# EAGLE design CFT-PB2-smd-revX (EAGLE 5.11)
DRAWN_BY: Alexios; PROJECT_NAME: CFT Mini-Computer; REVISION: Rev B; SHEET_DESCRIPTION: Address Register, Address Bus Drivers & Termination, Autoindex Logic, Device Decoder; SIMULATION_FILENAME: addressing.v; URL: http://www.bedroomlan.org/cft

## Sheet 1 of 6
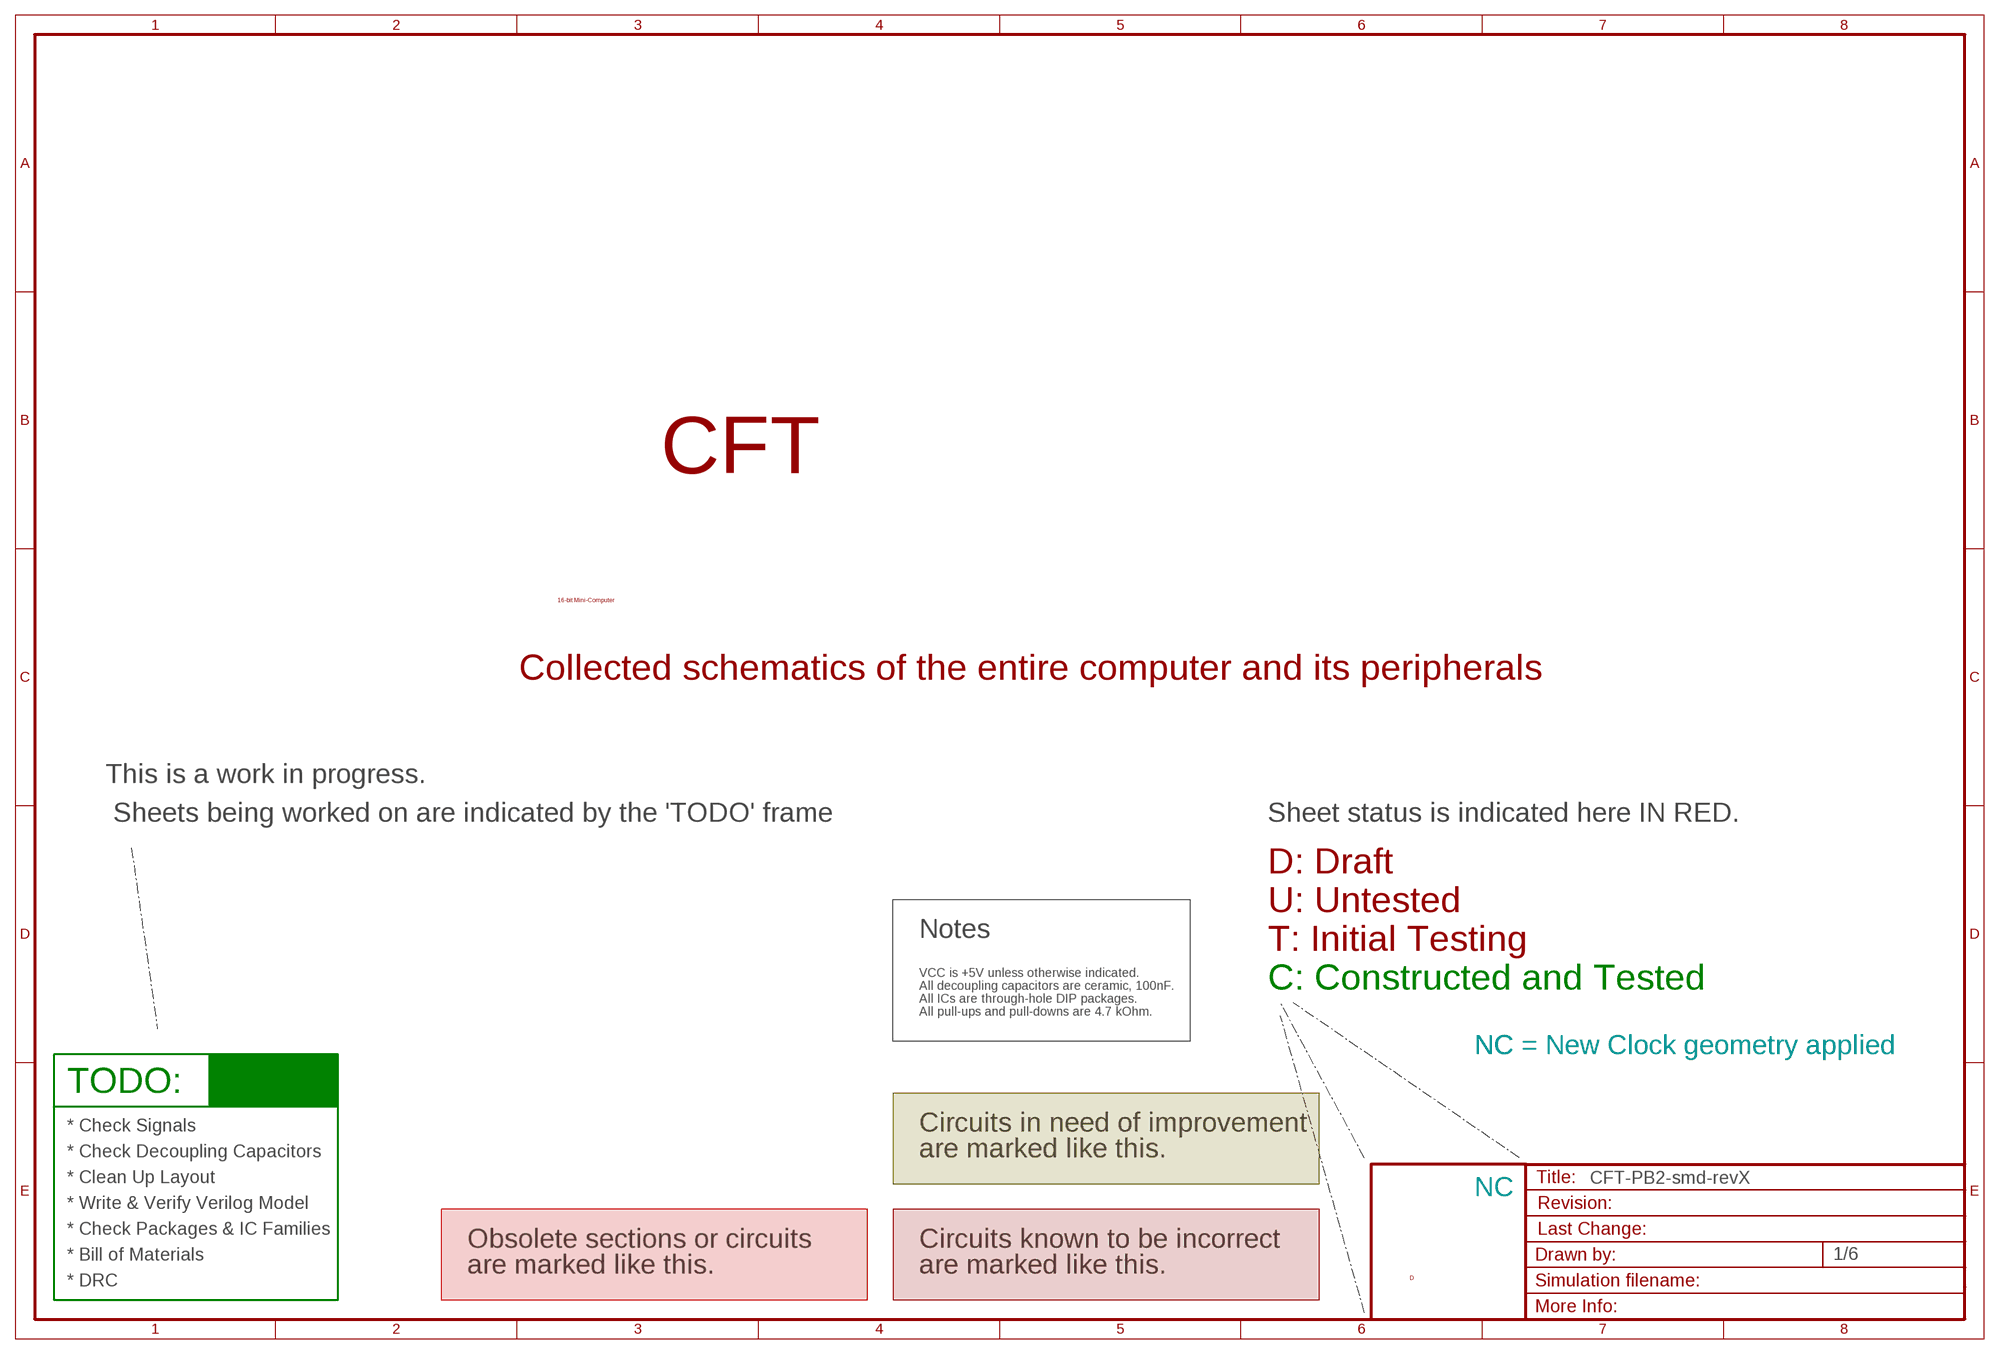
[diagram p0: schematic, sheet 1]

### Notes on the sheet
- CFT
- 16-bit Mini-Computer
- Collected schematics of the entire computer and its peripherals
- This is a work in progress.
- Sheets being worked on are indicated by the 'TODO' frame | Sheet status is indicated here IN RED.
- D: Draft
- U: Untested
- Notes
- T: Initial Testing
- VCC is +5V unless otherwise indicated.
- All decoupling capacitors are ceramic, 100nF. | C: Constructed and Tested
- All ICs are through-hole DIP packages.
- All pull-ups and pull-downs are 4.7 kOhm.
- NC | NC = New Clock geometry applied
- TODO:
- * Check Signals | Circuits in need of improvement
- * Check Decoupling Capacitors | are marked like this.
- * Clean Up Layout
- NC
- * Write & Verify Verilog Model
- * Check Packages & IC Families
- Obsolete sections or circuits | Circuits known to be incorrect
- * Bill of Materials
- are marked like this. | are marked like this.
- D
- * DRC

## Sheet 2 of 6
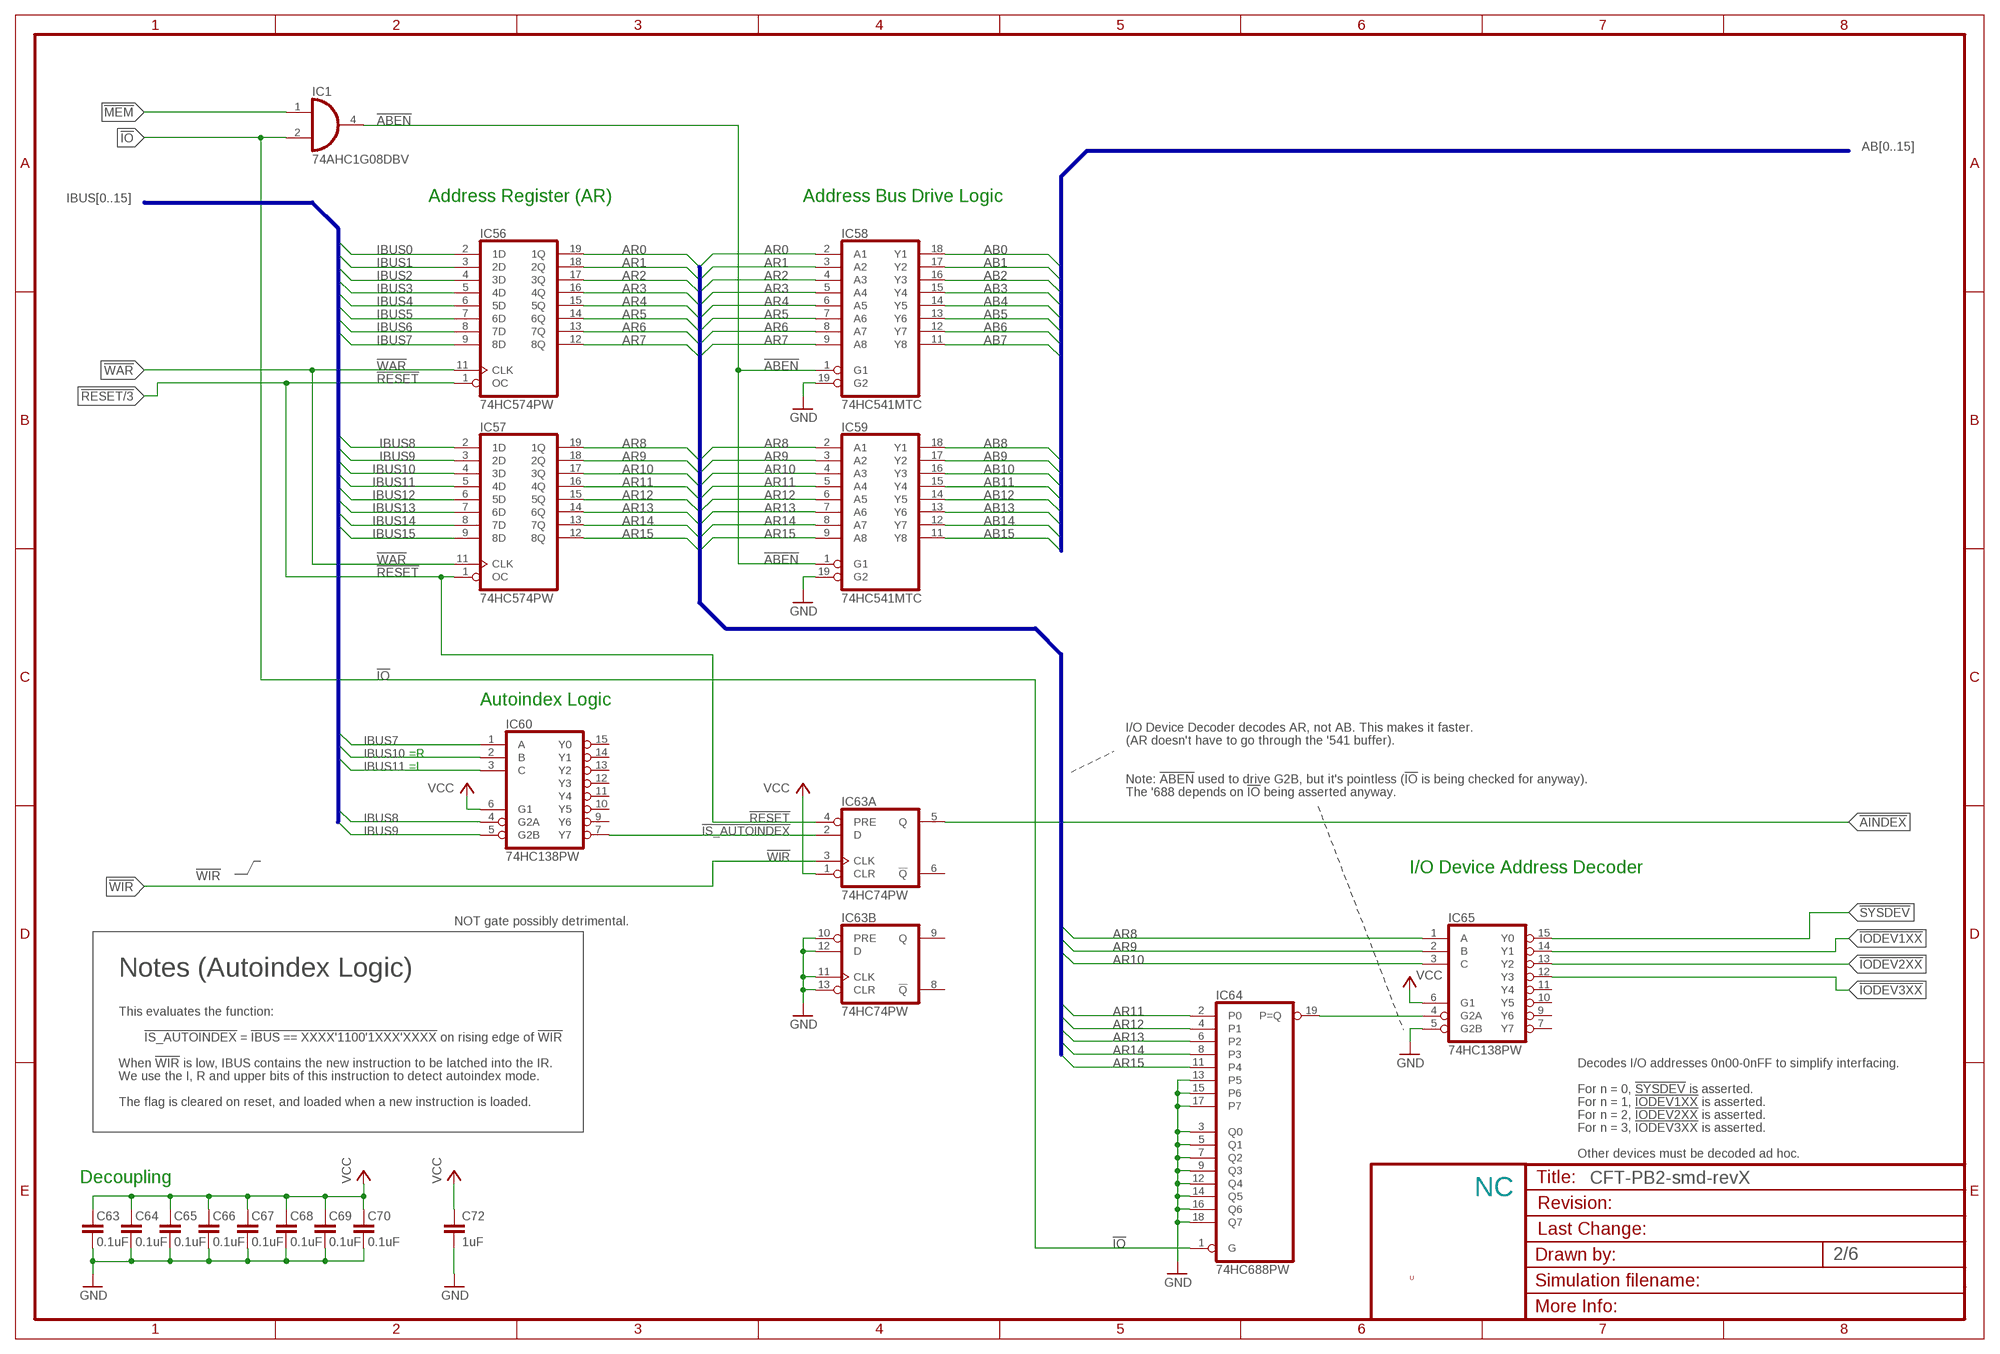
[diagram p1: schematic, sheet 2]

### Parts
C63  0.1uF  C-EUC0805K  [C0805K]
C64  0.1uF  C-EUC0805K  [C0805K]
C65  0.1uF  C-EUC0805K  [C0805K]
C66  0.1uF  C-EUC0805K  [C0805K]
C67  0.1uF  C-EUC0805K  [C0805K]
C68  0.1uF  C-EUC0805K  [C0805K]
C69  0.1uF  C-EUC0805K  [C0805K]
C70  0.1uF  C-EUC0805K  [C0805K]
C72  1uF  C-EUC0805K  [C0805K]
IC1  74AHC1G08DBV  [SOT23-5]
IC56  74HC574PW  [TSSOP20]
IC57  74HC574PW  [TSSOP20]
IC58  74HC541MTC  [TSSOP20]
IC59  74HC541MTC  [TSSOP20]
IC60  74HC138PW  [TSSOP16]
IC63  74HC74PW  [TSSOP16]
IC64  74HC688PW  [TSSOP20]
IC65  74HC138PW  [TSSOP16]

### Nets
!ABEN: IC1.4(O) IC58.1(G1) IC59.1(G1)
!AINDEX: IC63.5(A:Q) ; also sheet 6
!IO: IC1.2(I1) IC64.1(G) ; also sheet 6
!IODEV1XX: IC65.14(Y1) ; also sheet 6
!IODEV2XX: IC65.13(Y2) ; also sheet 6
!IODEV3XX: IC65.12(Y3) ; also sheet 6
!IS_AUTOINDEX: IC60.7(Y7) IC63.2(A:D)
!MEM: IC1.1(I0) ; also sheet 6
!RESET: IC56.1(OC) IC57.1(OC) IC63.4(A:PRE) ; also sheet 3,6
!SYSDEV: IC65.15(Y0) ; also sheet 6
!WAR: IC56.11(CLK) IC57.11(CLK) ; also sheet 6
!WIR: IC63.3(A:CLK) ; also sheet 6
AB0: IC58.18(Y1) ; also sheet 6
AB1: IC58.17(Y2) ; also sheet 6
AB2: IC58.16(Y3) ; also sheet 6
AB3: IC58.15(Y4) ; also sheet 6
AB4: IC58.14(Y5) ; also sheet 6
AB5: IC58.13(Y6) ; also sheet 6
AB6: IC58.12(Y7) ; also sheet 6
AB7: IC58.11(Y8) ; also sheet 6
AB8: IC59.18(Y1) ; also sheet 6
AB9: IC59.17(Y2) ; also sheet 6
AB10: IC59.16(Y3) ; also sheet 6
AB11: IC59.15(Y4) ; also sheet 6
AB12: IC59.14(Y5) ; also sheet 6
AB13: IC59.13(Y6) ; also sheet 6
AB14: IC59.12(Y7) ; also sheet 6
AB15: IC59.11(Y8) ; also sheet 6
AR0: IC56.19(1Q) IC58.2(A1)
AR1: IC56.18(2Q) IC58.3(A2)
AR2: IC56.17(3Q) IC58.4(A3)
AR3: IC56.16(4Q) IC58.5(A4)
AR4: IC56.15(5Q) IC58.6(A5)
AR5: IC56.14(6Q) IC58.7(A6)
AR6: IC56.13(7Q) IC58.8(A7)
AR7: IC56.12(8Q) IC58.9(A8)
AR8: IC57.19(1Q) IC59.2(A1) IC65.1(A)
AR9: IC57.18(2Q) IC59.3(A2) IC65.2(B)
AR10: IC57.17(3Q) IC59.4(A3) IC65.3(C)
AR11: IC57.16(4Q) IC59.5(A4) IC64.2(P0)
AR12: IC57.15(5Q) IC59.6(A5) IC64.4(P1)
AR13: IC57.14(6Q) IC59.7(A6) IC64.6(P2)
AR14: IC57.13(7Q) IC59.8(A7) IC64.8(P3)
AR15: IC57.12(8Q) IC59.9(A8) IC64.11(P4)
GND [low power]: C63.1 C64.1 C65.1 C66.1 C67.1 C68.1 C69.1 C70.1 C72.2 IC58.19(G2) IC59.19(G2) IC63.10(B:PRE) IC63.11(B:CLK) IC63.12(B:D) IC63.13(B:CLR) IC64.3(Q0) IC64.5(Q1) IC64.7(Q2) IC64.9(Q3) IC64.12(Q4) IC64.13(P5) IC64.14(Q5) IC64.15(P6) IC64.16(Q6) IC64.17(P7) IC64.18(Q7) IC65.5(G2B) ; also sheet 3,4,5,6
IBUS0: IC56.2(1D) ; also sheet 3,4,5,6
IBUS1: IC56.3(2D) ; also sheet 3,4,5,6
IBUS2: IC56.4(3D) ; also sheet 3,4,5,6
IBUS3: IC56.5(4D) ; also sheet 3,4,5,6
IBUS4: IC56.6(5D) ; also sheet 3,4,5,6
IBUS5: IC56.7(6D) ; also sheet 3,4,5,6
IBUS6: IC56.8(7D) ; also sheet 3,4,5,6
IBUS7: IC56.9(8D) IC60.1(A) ; also sheet 3,4,5,6
IBUS8: IC57.2(1D) IC60.4(G2A) ; also sheet 3,4,5,6
IBUS9: IC57.3(2D) IC60.5(G2B) ; also sheet 3,4,5,6
IBUS10: IC57.4(3D) IC60.2(B) ; also sheet 3,4,5,6
IBUS11: IC57.5(4D) IC60.3(C) ; also sheet 3,4,5,6
IBUS12: IC57.6(5D) ; also sheet 3,4,5,6
IBUS13: IC57.7(6D) ; also sheet 3,4,5,6
IBUS14: IC57.8(7D) ; also sheet 3,4,5,6
IBUS15: IC57.9(8D) ; also sheet 3,4,5,6
N$95: IC64.19(P=Q) IC65.4(G2A)
VCC [low power]: C63.2 C64.2 C65.2 C66.2 C67.2 C68.2 C69.2 C70.2 C72.1 IC60.6(G1) IC63.1(A:CLR) IC65.6(G1) ; also sheet 3,4,5,6
Unconnected: IC60.9(Y6) IC60.10(Y5) IC60.11(Y4) IC60.12(Y3) IC60.13(Y2) IC60.14(Y1) IC60.15(Y0) IC63.6(A:!Q) IC63.8(B:!Q) IC63.9(B:Q) IC65.7(Y7) IC65.9(Y6) IC65.10(Y5) IC65.11(Y4)

### Buses
AR[0..15]
IBUS[0..15]
AB[0..15]

### Notes on the sheet
- Address Register (AR) | Address Bus Drive Logic
- Autoindex Logic
- I/O Device Decoder decodes AR, not AB. This makes it faster.
- (AR doesn't have to go through the '541 buffer).
- =R
- =I
- Note: !ABEN! used to drive G2B, but it's pointless (!IO! is being checked for anyway).
- The '688 depends on !IO! being asserted anyway.
- I/O Device Address Decoder
- NOT gate possibly detrimental.
- Notes (Autoindex Logic)
- This evaluates the function:
- !IS_AUTOINDEX! = !IBUS == XXXX'1100'1XXX'XXXX! on rising edge of !WIR!
- When !WIR! is low, IBUS contains the new instruction to be latched into the IR. | Decodes I/O addresses 0n00-0nFF to simplify interfacing.
- We use the I, R and upper bits of this instruction to detect autoindex mode.
- For n = 0, !SYSDEV! is asserted.
- The flag is cleared on reset, and loaded when a new instruction is loaded. | For n = 1, !IODEV1XX! is asserted.
- For n = 2, !IODEV2XX! is asserted.
- For n = 3, !IODEV3XX! is asserted.
- Other devices must be decoded ad hoc.
- Decoupling
- NC
- U

## Sheet 3 of 6
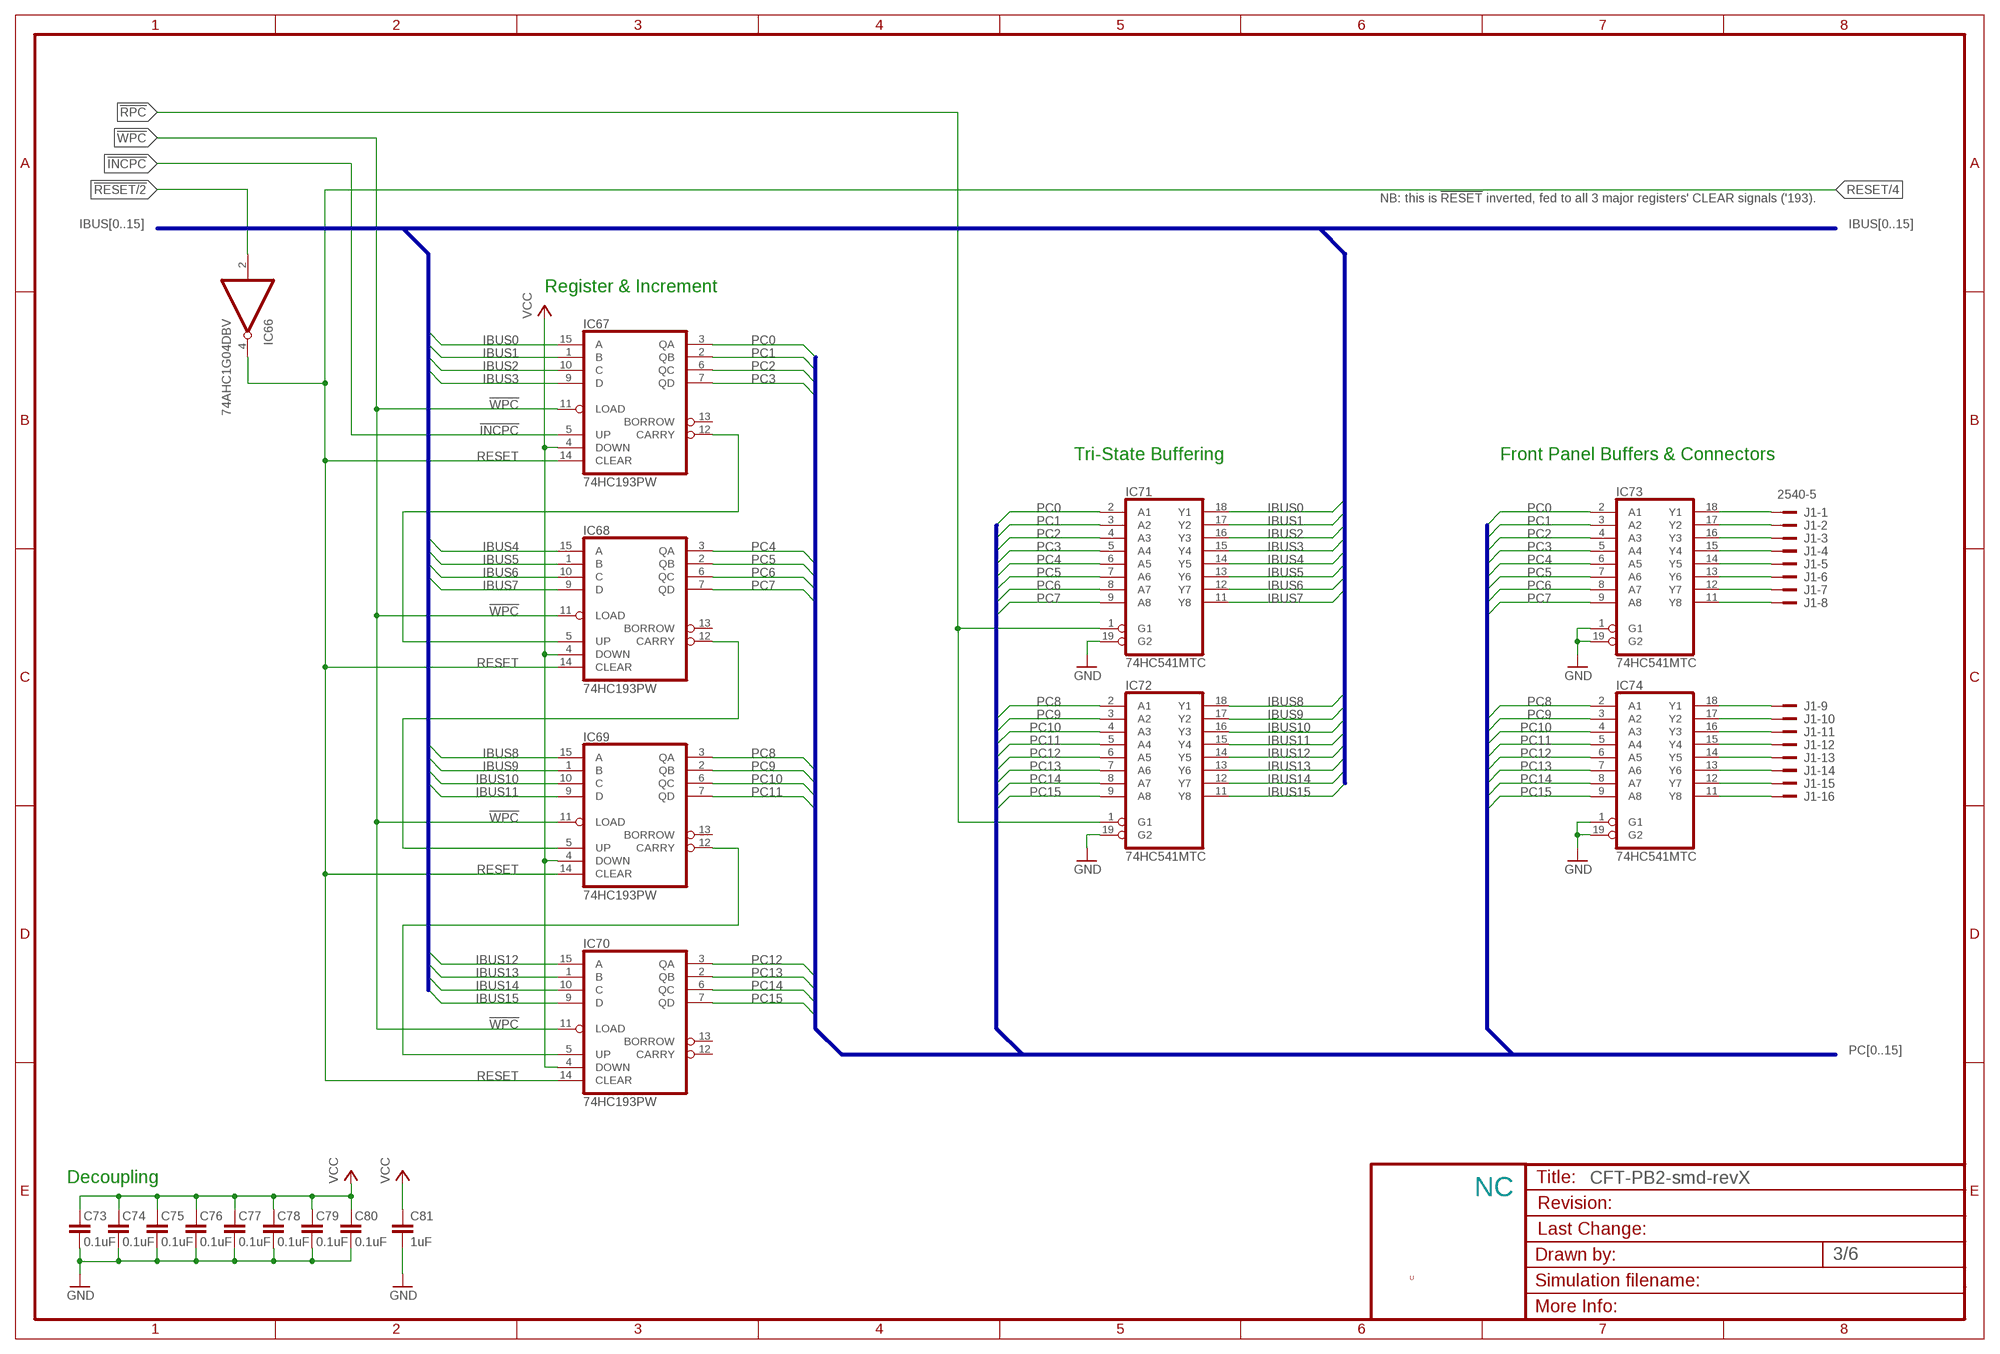
[diagram p2: schematic, sheet 3]

### Parts
C73  0.1uF  C-EUC0805K  [C0805K]
C74  0.1uF  C-EUC0805K  [C0805K]
C75  0.1uF  C-EUC0805K  [C0805K]
C76  0.1uF  C-EUC0805K  [C0805K]
C77  0.1uF  C-EUC0805K  [C0805K]
C78  0.1uF  C-EUC0805K  [C0805K]
C79  0.1uF  C-EUC0805K  [C0805K]
C80  0.1uF  C-EUC0805K  [C0805K]
C81  1uF  C-EUC0805K  [C0805K]
IC66  74AHC1G04DBV  [SOT23-5]
IC67  74HC193PW  [TSSOP16]
IC68  74HC193PW  [TSSOP16]
IC69  74HC193PW  [TSSOP16]
IC70  74HC193PW  [TSSOP16]
IC71  74HC541MTC  [TSSOP20]
IC72  74HC541MTC  [TSSOP20]
IC73  74HC541MTC  [TSSOP20]
IC74  74HC541MTC  [TSSOP20]
J1  2540-5  [PAK100/2500-5-40]

### Nets
!INCPC: IC67.5(UP) ; also sheet 6
!RESET: IC66.2(I) ; also sheet 2,6
!RPC: IC71.1(G1) IC72.1(G1) ; also sheet 6
!WPC: IC67.11(LOAD) IC68.11(LOAD) IC69.11(LOAD) IC70.11(LOAD) ; also sheet 6
GND [low power]: C73.1 C74.1 C75.1 C76.1 C77.1 C78.1 C79.1 C80.1 C81.2 IC71.19(G2) IC72.19(G2) IC73.1(G1) IC73.19(G2) IC74.1(G1) IC74.19(G2) ; also sheet 2,4,5,6
IBUS0: IC67.15(A) IC71.18(Y1) ; also sheet 2,4,5,6
IBUS1: IC67.1(B) IC71.17(Y2) ; also sheet 2,4,5,6
IBUS2: IC67.10(C) IC71.16(Y3) ; also sheet 2,4,5,6
IBUS3: IC67.9(D) IC71.15(Y4) ; also sheet 2,4,5,6
IBUS4: IC68.15(A) IC71.14(Y5) ; also sheet 2,4,5,6
IBUS5: IC68.1(B) IC71.13(Y6) ; also sheet 2,4,5,6
IBUS6: IC68.10(C) IC71.12(Y7) ; also sheet 2,4,5,6
IBUS7: IC68.9(D) IC71.11(Y8) ; also sheet 2,4,5,6
IBUS8: IC69.15(A) IC72.18(Y1) ; also sheet 2,4,5,6
IBUS9: IC69.1(B) IC72.17(Y2) ; also sheet 2,4,5,6
IBUS10: IC69.10(C) IC72.16(Y3) ; also sheet 2,4,5,6
IBUS11: IC69.9(D) IC72.15(Y4) ; also sheet 2,4,5,6
IBUS12: IC70.15(A) IC72.14(Y5) ; also sheet 2,4,5,6
IBUS13: IC70.1(B) IC72.13(Y6) ; also sheet 2,4,5,6
IBUS14: IC70.10(C) IC72.12(Y7) ; also sheet 2,4,5,6
IBUS15: IC70.9(D) IC72.11(Y8) ; also sheet 2,4,5,6
N$70: IC67.12(CARRY) IC68.5(UP)
N$71: IC68.12(CARRY) IC69.5(UP)
N$734: IC69.12(CARRY) IC70.5(UP)
N$736: IC73.18(Y1) J1.1
N$737: IC73.17(Y2) J1.2
N$738: IC73.16(Y3) J1.3
N$740: IC73.15(Y4) J1.4
N$741: IC73.14(Y5) J1.5
N$742: IC73.13(Y6) J1.6
N$743: IC73.12(Y7) J1.7
N$744: IC73.11(Y8) J1.8
N$745: IC74.18(Y1) J1.9
N$746: IC74.17(Y2) J1.10
N$747: IC74.16(Y3) J1.11
N$748: IC74.15(Y4) J1.12
N$749: IC74.14(Y5) J1.13
N$750: IC74.13(Y6) J1.14
N$751: IC74.12(Y7) J1.15
N$752: IC74.11(Y8) J1.16
PC0: IC67.3(QA) IC71.2(A1) IC73.2(A1)
PC1: IC67.2(QB) IC71.3(A2) IC73.3(A2)
PC2: IC67.6(QC) IC71.4(A3) IC73.4(A3)
PC3: IC67.7(QD) IC71.5(A4) IC73.5(A4)
PC4: IC68.3(QA) IC71.6(A5) IC73.6(A5)
PC5: IC68.2(QB) IC71.7(A6) IC73.7(A6)
PC6: IC68.6(QC) IC71.8(A7) IC73.8(A7)
PC7: IC68.7(QD) IC71.9(A8) IC73.9(A8)
PC8: IC69.3(QA) IC72.2(A1) IC74.2(A1)
PC9: IC69.2(QB) IC72.3(A2) IC74.3(A2)
PC10: IC69.6(QC) IC72.4(A3) IC74.4(A3) ; also sheet 6
PC11: IC69.7(QD) IC72.5(A4) IC74.5(A4) ; also sheet 6
PC12: IC70.3(QA) IC72.6(A5) IC74.6(A5) ; also sheet 6
PC13: IC70.2(QB) IC72.7(A6) IC74.7(A6) ; also sheet 6
PC14: IC70.6(QC) IC72.8(A7) IC74.8(A7) ; also sheet 6
PC15: IC70.7(QD) IC72.9(A8) IC74.9(A8) ; also sheet 6
RESET: IC66.4(O) IC67.14(CLEAR) IC68.14(CLEAR) IC69.14(CLEAR) IC70.14(CLEAR) ; also sheet 4,5
VCC [low power]: C73.2 C74.2 C75.2 C76.2 C77.2 C78.2 C79.2 C80.2 C81.1 IC67.4(DOWN) IC68.4(DOWN) IC69.4(DOWN) IC70.4(DOWN) ; also sheet 2,4,5,6
Unconnected: IC67.13(BORROW) IC68.13(BORROW) IC69.13(BORROW) IC70.12(CARRY) IC70.13(BORROW)

### Buses
IBUS[0..15]
PC[0..15]

### Notes on the sheet
- NB: this is !RESET! inverted, fed to all 3 major registers' CLEAR signals ('193).
- Register & Increment
- Tri-State Buffering | Front Panel Buffers & Connectors
- Decoupling
- NC
- U

## Sheet 4 of 6
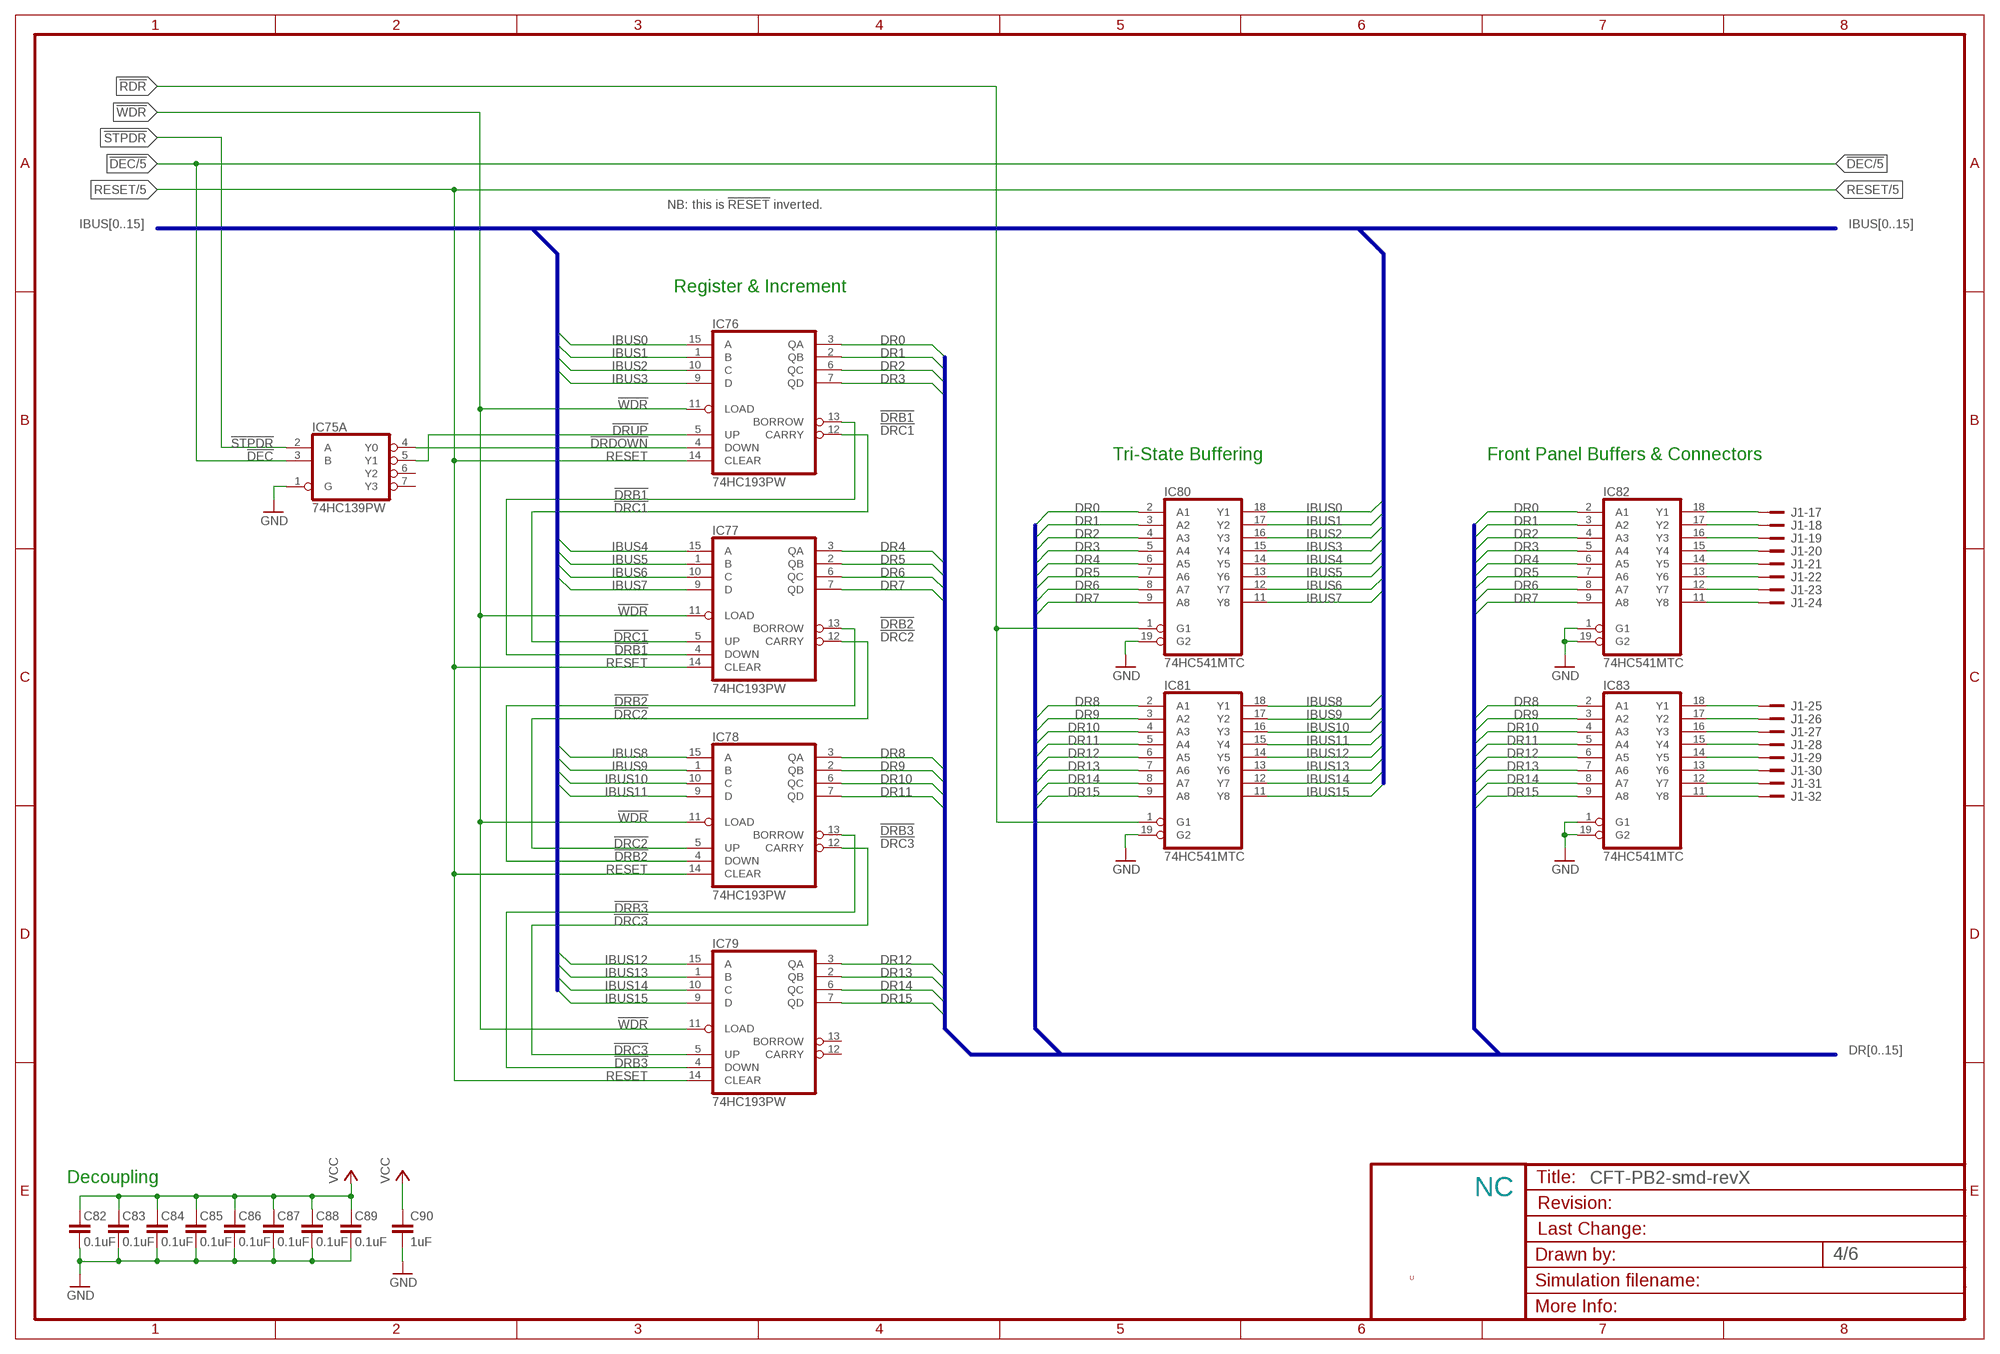
[diagram p3: schematic, sheet 4]

### Parts
C82  0.1uF  C-EUC0805K  [C0805K]
C83  0.1uF  C-EUC0805K  [C0805K]
C84  0.1uF  C-EUC0805K  [C0805K]
C85  0.1uF  C-EUC0805K  [C0805K]
C86  0.1uF  C-EUC0805K  [C0805K]
C87  0.1uF  C-EUC0805K  [C0805K]
C88  0.1uF  C-EUC0805K  [C0805K]
C89  0.1uF  C-EUC0805K  [C0805K]
C90  1uF  C-EUC0805K  [C0805K]
IC75  74HC139PW  [TSSOP16]
IC76  74HC193PW  [TSSOP16]
IC77  74HC193PW  [TSSOP16]
IC78  74HC193PW  [TSSOP16]
IC79  74HC193PW  [TSSOP16]
IC80  74HC541MTC  [TSSOP20]
IC81  74HC541MTC  [TSSOP20]
IC82  74HC541MTC  [TSSOP20]
IC83  74HC541MTC  [TSSOP20]

### Nets
!DEC: IC75.3(A:B) ; also sheet 5,6
!DRB1: IC76.13(BORROW) IC77.4(DOWN)
!DRB2: IC77.13(BORROW) IC78.4(DOWN)
!DRB3: IC78.13(BORROW) IC79.4(DOWN)
!DRC1: IC76.12(CARRY) IC77.5(UP)
!DRC2: IC77.12(CARRY) IC78.5(UP)
!DRC3: IC78.12(CARRY) IC79.5(UP)
!DRDOWN: IC75.4(A:Y0) IC76.4(DOWN)
!DRUP: IC75.5(A:Y1) IC76.5(UP)
!RDR: IC80.1(G1) IC81.1(G1) ; also sheet 6
!STPDR: IC75.2(A:A) ; also sheet 6
!WDR: IC76.11(LOAD) IC77.11(LOAD) IC78.11(LOAD) IC79.11(LOAD) ; also sheet 6
DR0: IC76.3(QA) IC80.2(A1) IC82.2(A1)
DR1: IC76.2(QB) IC80.3(A2) IC82.3(A2)
DR2: IC76.6(QC) IC80.4(A3) IC82.4(A3)
DR3: IC76.7(QD) IC80.5(A4) IC82.5(A4)
DR4: IC77.3(QA) IC80.6(A5) IC82.6(A5)
DR5: IC77.2(QB) IC80.7(A6) IC82.7(A6)
DR6: IC77.6(QC) IC80.8(A7) IC82.8(A7)
DR7: IC77.7(QD) IC80.9(A8) IC82.9(A8)
DR8: IC78.3(QA) IC81.2(A1) IC83.2(A1)
DR9: IC78.2(QB) IC81.3(A2) IC83.3(A2)
DR10: IC78.6(QC) IC81.4(A3) IC83.4(A3)
DR11: IC78.7(QD) IC81.5(A4) IC83.5(A4)
DR12: IC79.3(QA) IC81.6(A5) IC83.6(A5)
DR13: IC79.2(QB) IC81.7(A6) IC83.7(A6)
DR14: IC79.6(QC) IC81.8(A7) IC83.8(A7)
DR15: IC79.7(QD) IC81.9(A8) IC83.9(A8)
GND [low power]: C82.1 C83.1 C84.1 C85.1 C86.1 C87.1 C88.1 C89.1 C90.2 IC75.1(A:G) IC80.19(G2) IC81.19(G2) IC82.1(G1) IC82.19(G2) IC83.1(G1) IC83.19(G2) ; also sheet 2,3,5,6
IBUS0: IC76.15(A) IC80.18(Y1) ; also sheet 2,3,5,6
IBUS1: IC76.1(B) IC80.17(Y2) ; also sheet 2,3,5,6
IBUS2: IC76.10(C) IC80.16(Y3) ; also sheet 2,3,5,6
IBUS3: IC76.9(D) IC80.15(Y4) ; also sheet 2,3,5,6
IBUS4: IC77.15(A) IC80.14(Y5) ; also sheet 2,3,5,6
IBUS5: IC77.1(B) IC80.13(Y6) ; also sheet 2,3,5,6
IBUS6: IC77.10(C) IC80.12(Y7) ; also sheet 2,3,5,6
IBUS7: IC77.9(D) IC80.11(Y8) ; also sheet 2,3,5,6
IBUS8: IC78.15(A) IC81.18(Y1) ; also sheet 2,3,5,6
IBUS9: IC78.1(B) IC81.17(Y2) ; also sheet 2,3,5,6
IBUS10: IC78.10(C) IC81.16(Y3) ; also sheet 2,3,5,6
IBUS11: IC78.9(D) IC81.15(Y4) ; also sheet 2,3,5,6
IBUS12: IC79.15(A) IC81.14(Y5) ; also sheet 2,3,5,6
IBUS13: IC79.1(B) IC81.13(Y6) ; also sheet 2,3,5,6
IBUS14: IC79.10(C) IC81.12(Y7) ; also sheet 2,3,5,6
IBUS15: IC79.9(D) IC81.11(Y8) ; also sheet 2,3,5,6
N$753: IC82.18(Y1) J1.17
N$754: IC82.17(Y2) J1.18
N$755: IC82.16(Y3) J1.19
N$756: IC82.15(Y4) J1.20
N$757: IC82.14(Y5) J1.21
N$758: IC82.13(Y6) J1.22
N$759: IC82.12(Y7) J1.23
N$760: IC82.11(Y8) J1.24
N$761: IC83.18(Y1) J1.25
N$762: IC83.17(Y2) J1.26
N$763: IC83.16(Y3) J1.27
N$764: IC83.15(Y4) J1.28
N$765: IC83.14(Y5) J1.29
N$766: IC83.13(Y6) J1.30
N$767: IC83.12(Y7) J1.31
N$768: IC83.11(Y8) J1.32
RESET: IC76.14(CLEAR) IC77.14(CLEAR) IC78.14(CLEAR) IC79.14(CLEAR) ; also sheet 3,5
VCC [low power]: C82.2 C83.2 C84.2 C85.2 C86.2 C87.2 C88.2 C89.2 C90.1 ; also sheet 2,3,5,6
Unconnected: IC75.6(A:Y2) IC75.7(A:Y3) IC79.12(CARRY) IC79.13(BORROW)

### Buses
IBUS[0..15]
DR[0..15]

### Notes on the sheet
- NB: this is !RESET! inverted.
- Register & Increment
- Tri-State Buffering | Front Panel Buffers & Connectors
- Decoupling
- NC
- U

## Sheet 5 of 6
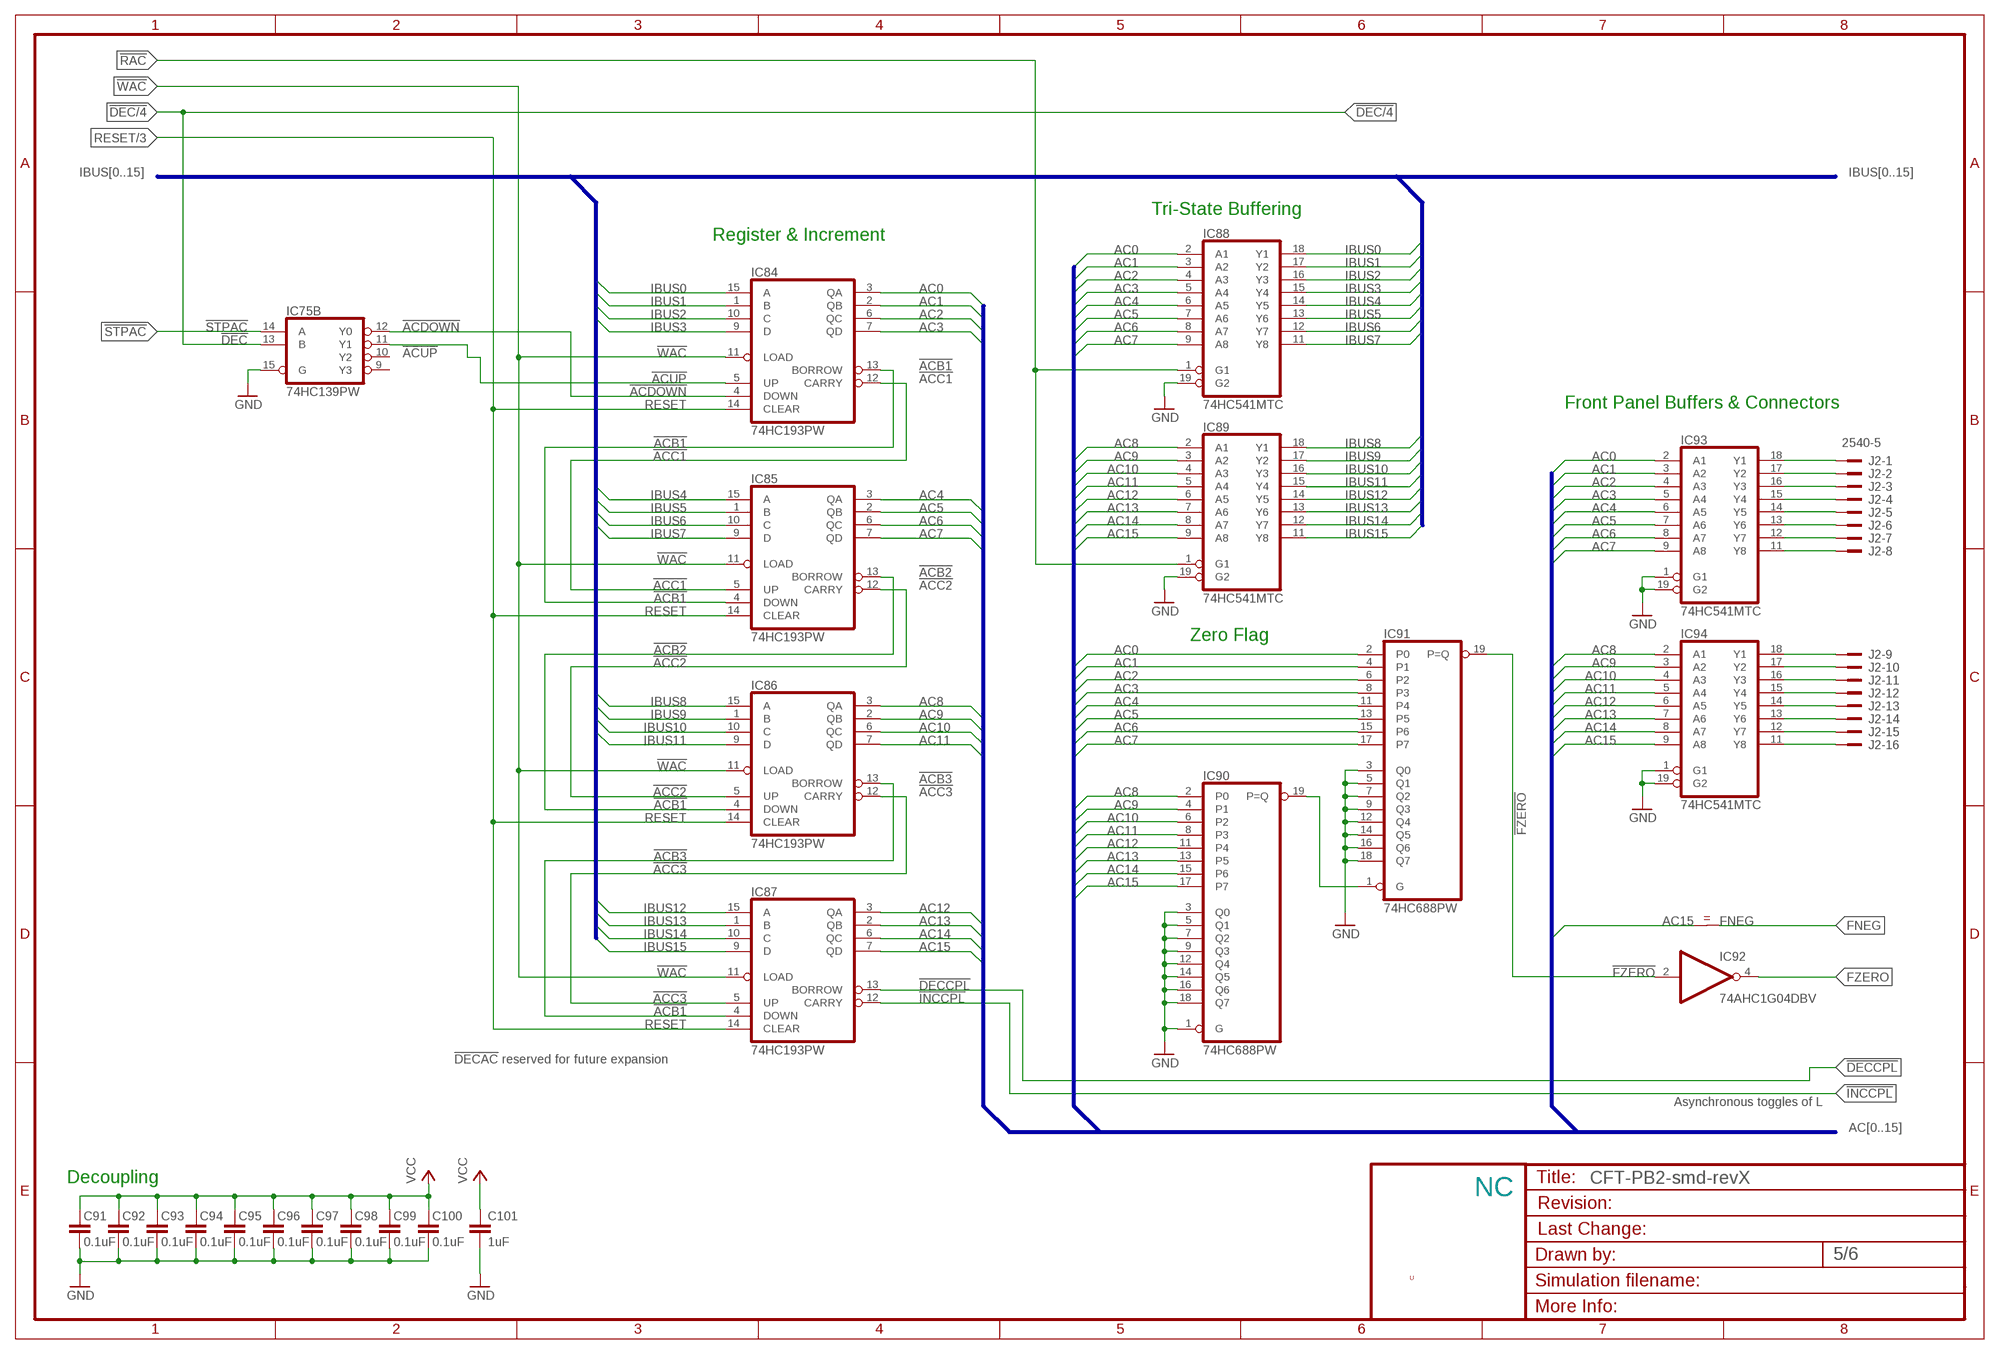
[diagram p4: schematic, sheet 5]

### Parts
C91  0.1uF  C-EUC0805K  [C0805K]
C92  0.1uF  C-EUC0805K  [C0805K]
C93  0.1uF  C-EUC0805K  [C0805K]
C94  0.1uF  C-EUC0805K  [C0805K]
C95  0.1uF  C-EUC0805K  [C0805K]
C96  0.1uF  C-EUC0805K  [C0805K]
C97  0.1uF  C-EUC0805K  [C0805K]
C98  0.1uF  C-EUC0805K  [C0805K]
C99  0.1uF  C-EUC0805K  [C0805K]
C100  0.1uF  C-EUC0805K  [C0805K]
C101  1uF  C-EUC0805K  [C0805K]
IC84  74HC193PW  [TSSOP16]
IC85  74HC193PW  [TSSOP16]
IC86  74HC193PW  [TSSOP16]
IC87  74HC193PW  [TSSOP16]
IC88  74HC541MTC  [TSSOP20]
IC89  74HC541MTC  [TSSOP20]
IC90  74HC688PW  [TSSOP20]
IC91  74HC688PW  [TSSOP20]
IC92  74AHC1G04DBV  [SOT23-5]
IC93  74HC541MTC  [TSSOP20]
IC94  74HC541MTC  [TSSOP20]
J2  2540-5  [PAK100/2500-5-40]
X1  SIGNAL-RENAME  [SIGNAL-RENAME]

### Nets
!ACB1: IC84.13(BORROW) IC85.4(DOWN)
!ACB2: IC85.13(BORROW) IC86.4(DOWN)
!ACB3: IC86.13(BORROW) IC87.4(DOWN)
!ACC1: IC84.12(CARRY) IC85.5(UP)
!ACC2: IC85.12(CARRY) IC86.5(UP)
!ACC3: IC86.12(CARRY) IC87.5(UP)
!ACDOWN: IC75.12(B:Y0) IC84.4(DOWN)
!ACUP: IC75.11(B:Y1) IC84.5(UP)
!DEC: IC75.13(B:B) ; also sheet 4,6
!DECCPL: IC87.13(BORROW) ; also sheet 6
!FZERO: IC91.19(P=Q) IC92.2(I)
!INCCPL: IC87.12(CARRY) ; also sheet 6
!RAC: IC88.1(G1) IC89.1(G1) ; also sheet 6
!STPAC: IC75.14(B:A) ; also sheet 6
!WAC: IC84.11(LOAD) IC85.11(LOAD) IC86.11(LOAD) IC87.11(LOAD) ; also sheet 6
AC0: IC84.3(QA) IC88.2(A1) IC91.2(P0) IC93.2(A1) ; also sheet 6
AC1: IC84.2(QB) IC88.3(A2) IC91.4(P1) IC93.3(A2) ; also sheet 6
AC2: IC84.6(QC) IC88.4(A3) IC91.6(P2) IC93.4(A3) ; also sheet 6
AC3: IC84.7(QD) IC88.5(A4) IC91.8(P3) IC93.5(A4) ; also sheet 6
AC4: IC85.3(QA) IC88.6(A5) IC91.11(P4) IC93.6(A5) ; also sheet 6
AC5: IC85.2(QB) IC88.7(A6) IC91.13(P5) IC93.7(A6) ; also sheet 6
AC6: IC85.6(QC) IC88.8(A7) IC91.15(P6) IC93.8(A7) ; also sheet 6
AC7: IC85.7(QD) IC88.9(A8) IC91.17(P7) IC93.9(A8) ; also sheet 6
AC8: IC86.3(QA) IC89.2(A1) IC90.2(P0) IC94.2(A1) ; also sheet 6
AC9: IC86.2(QB) IC89.3(A2) IC90.4(P1) IC94.3(A2) ; also sheet 6
AC10: IC86.6(QC) IC89.4(A3) IC90.6(P2) IC94.4(A3) ; also sheet 6
AC11: IC86.7(QD) IC89.5(A4) IC90.8(P3) IC94.5(A4) ; also sheet 6
AC12: IC87.3(QA) IC89.6(A5) IC90.11(P4) IC94.6(A5) ; also sheet 6
AC13: IC87.2(QB) IC89.7(A6) IC90.13(P5) IC94.7(A6) ; also sheet 6
AC14: IC87.6(QC) IC89.8(A7) IC90.15(P6) IC94.8(A7) ; also sheet 6
AC15: IC87.7(QD) IC89.9(A8) IC90.17(P7) IC94.9(A8) X1.P$1 ; also sheet 6
FNEG: X1.P$2 ; also sheet 6
FZERO: IC92.4(O) ; also sheet 6
GND [low power]: C91.1 C92.1 C93.1 C94.1 C95.1 C96.1 C97.1 C98.1 C99.1 C100.1 C101.2 IC75.15(B:G) IC88.19(G2) IC89.19(G2) IC90.1(G) IC90.3(Q0) IC90.5(Q1) IC90.7(Q2) IC90.9(Q3) IC90.12(Q4) IC90.14(Q5) IC90.16(Q6) IC90.18(Q7) IC91.3(Q0) IC91.5(Q1) IC91.7(Q2) IC91.9(Q3) IC91.12(Q4) IC91.14(Q5) IC91.16(Q6) IC91.18(Q7) IC93.1(G1) IC93.19(G2) IC94.1(G1) IC94.19(G2) ; also sheet 2,3,4,6
IBUS0: IC84.15(A) IC88.18(Y1) ; also sheet 2,3,4,6
IBUS1: IC84.1(B) IC88.17(Y2) ; also sheet 2,3,4,6
IBUS2: IC84.10(C) IC88.16(Y3) ; also sheet 2,3,4,6
IBUS3: IC84.9(D) IC88.15(Y4) ; also sheet 2,3,4,6
IBUS4: IC85.15(A) IC88.14(Y5) ; also sheet 2,3,4,6
IBUS5: IC85.1(B) IC88.13(Y6) ; also sheet 2,3,4,6
IBUS6: IC85.10(C) IC88.12(Y7) ; also sheet 2,3,4,6
IBUS7: IC85.9(D) IC88.11(Y8) ; also sheet 2,3,4,6
IBUS8: IC86.15(A) IC89.18(Y1) ; also sheet 2,3,4,6
IBUS9: IC86.1(B) IC89.17(Y2) ; also sheet 2,3,4,6
IBUS10: IC86.10(C) IC89.16(Y3) ; also sheet 2,3,4,6
IBUS11: IC86.9(D) IC89.15(Y4) ; also sheet 2,3,4,6
IBUS12: IC87.15(A) IC89.14(Y5) ; also sheet 2,3,4,6
IBUS13: IC87.1(B) IC89.13(Y6) ; also sheet 2,3,4,6
IBUS14: IC87.10(C) IC89.12(Y7) ; also sheet 2,3,4,6
IBUS15: IC87.9(D) IC89.11(Y8) ; also sheet 2,3,4,6
N$773: IC93.18(Y1) J2.1
N$775: IC93.17(Y2) J2.2
N$776: IC93.16(Y3) J2.3
N$777: IC93.15(Y4) J2.4
N$778: IC93.14(Y5) J2.5
N$779: IC93.13(Y6) J2.6
N$780: IC93.12(Y7) J2.7
N$781: IC93.11(Y8) J2.8
N$782: IC94.18(Y1) J2.9
N$783: IC94.17(Y2) J2.10
N$784: IC94.16(Y3) J2.11
N$785: IC94.15(Y4) J2.12
N$786: IC94.14(Y5) J2.13
N$787: IC94.13(Y6) J2.14
N$788: IC94.12(Y7) J2.15
N$789: IC94.11(Y8) J2.16
N$793: IC90.19(P=Q) IC91.1(G)
RESET: IC84.14(CLEAR) IC85.14(CLEAR) IC86.14(CLEAR) IC87.14(CLEAR) ; also sheet 3,4
VCC [low power]: C91.2 C92.2 C93.2 C94.2 C95.2 C96.2 C97.2 C98.2 C99.2 C100.2 C101.1 ; also sheet 2,3,4,6
Unconnected: IC75.9(B:Y3) IC75.10(B:Y2)

### Buses
IBUS[0..15]
AC[0..15]

### Notes on the sheet
- Tri-State Buffering
- Register & Increment
- Front Panel Buffers & Connectors
- Zero Flag
- !DECAC! reserved for future expansion
- Asynchronous toggles of L
- Decoupling
- NC
- U

## Sheet 6 of 6
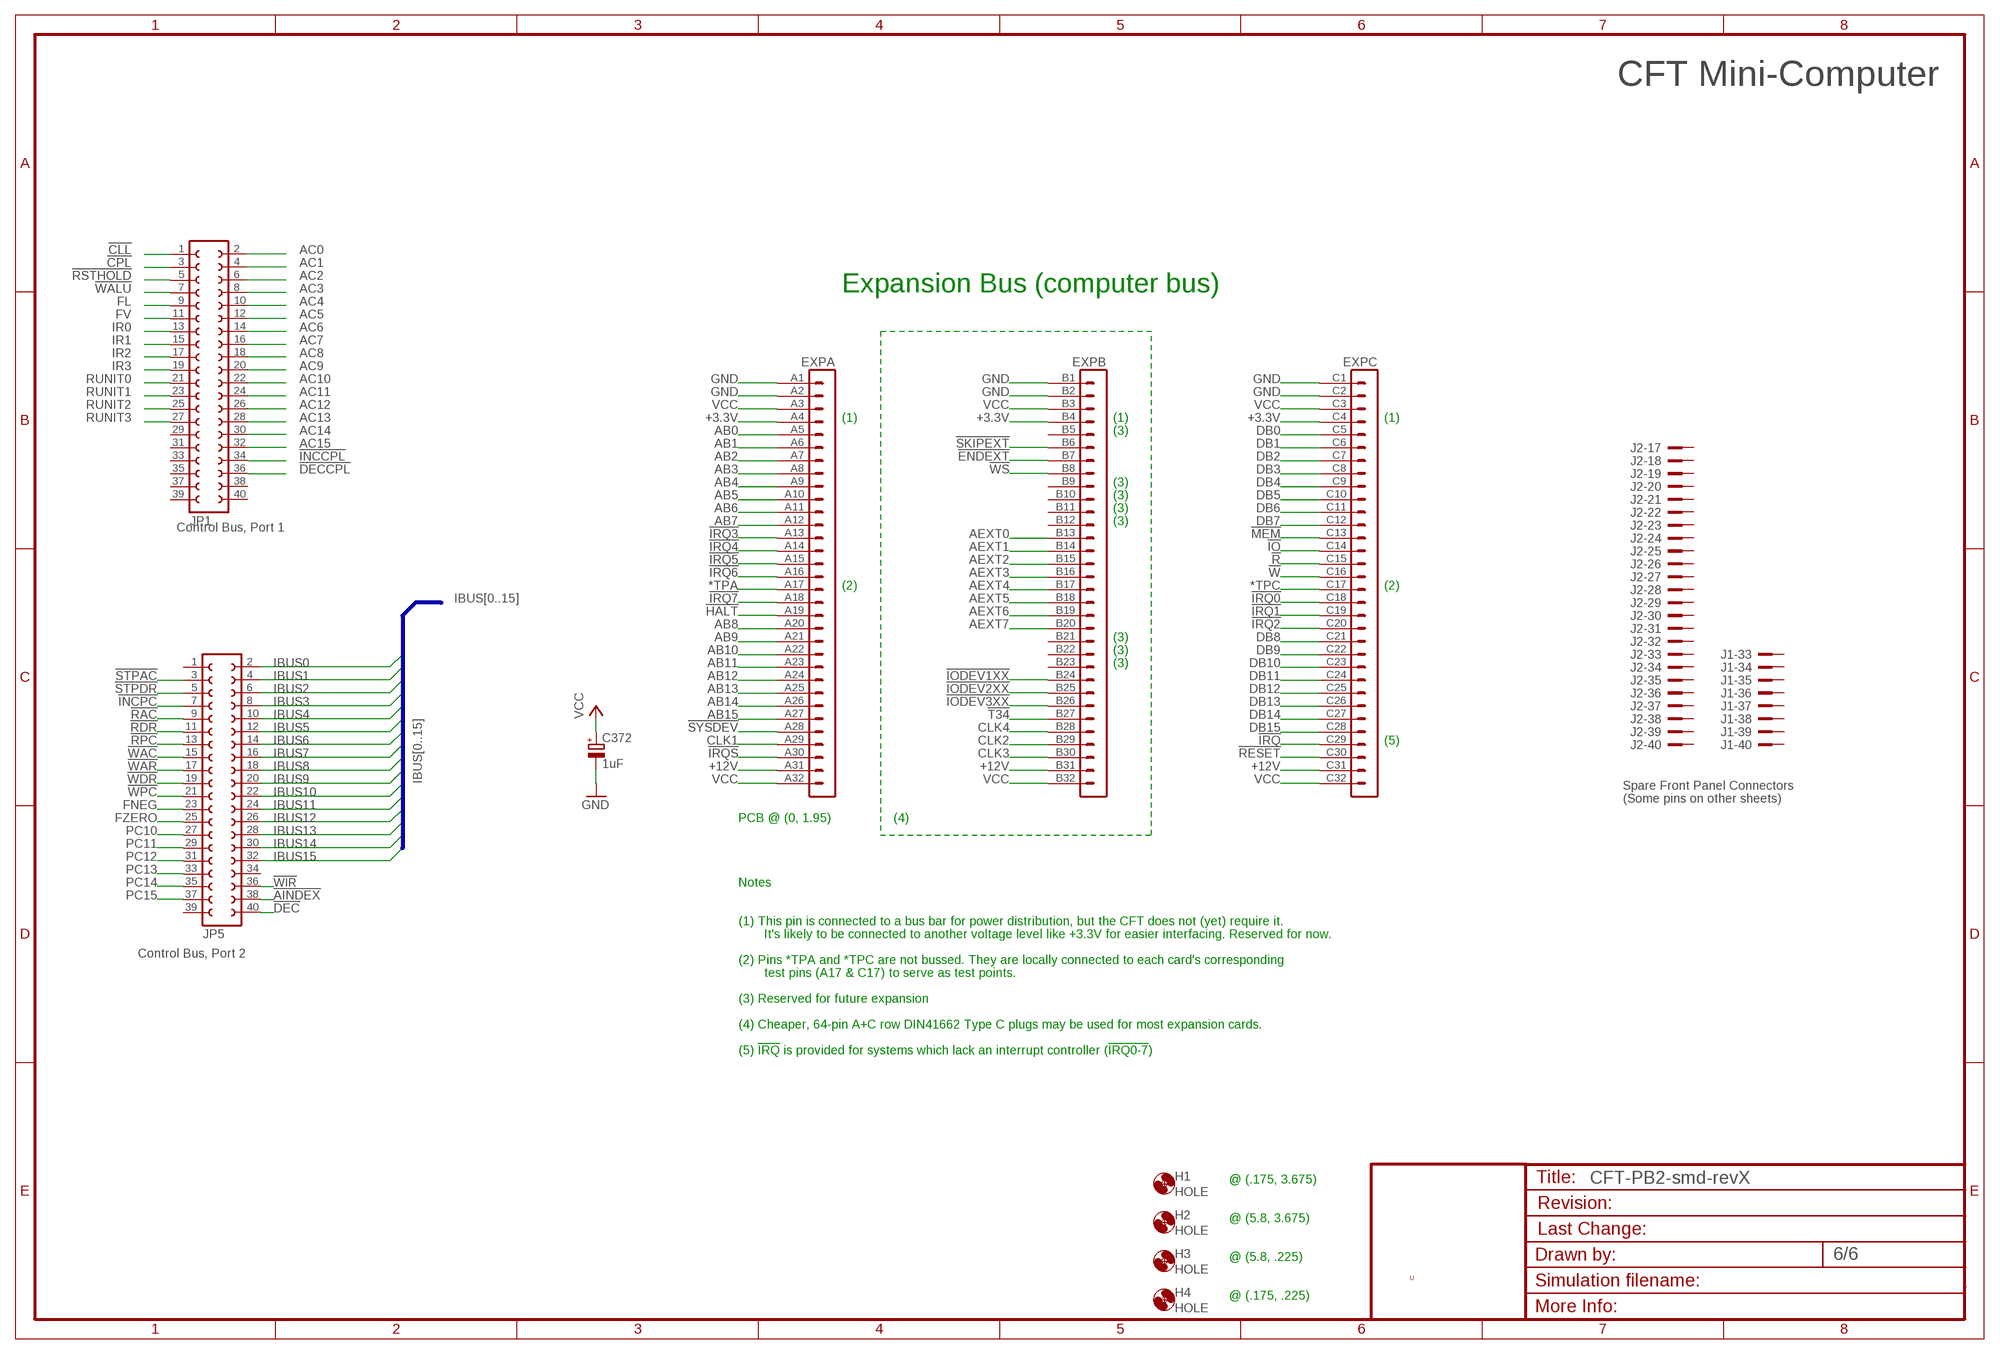
[diagram p5: schematic, sheet 6]

### Parts
C372  1uF  CPOL-EUE2.5-5  [E2,5-5]
EXP  VG96-3K  [VG96K]
H1  HOLE  [STANDOFF_28_60]
H2  HOLE  [STANDOFF_28_60]
H3  HOLE  [STANDOFF_28_60]
H4  HOLE  [STANDOFF_28_60]
JP1  FE20-2  [FE20-2]
JP5  FE20-2  [FE20-2]

### Nets
!AINDEX: JP5.38 ; also sheet 2
!CLL: JP1.1
!CPL: JP1.3
!DEC: JP5.40 ; also sheet 4,5
!DECCPL: JP1.36 ; also sheet 5
!ENDEXT: EXP.B7
!HALT: EXP.A19
!INCCPL: JP1.34 ; also sheet 5
!INCPC: JP5.7 ; also sheet 3
!IO: EXP.C14 ; also sheet 2
!IODEV1XX: EXP.B24 ; also sheet 2
!IODEV2XX: EXP.B25 ; also sheet 2
!IODEV3XX: EXP.B26 ; also sheet 2
!IRQ: EXP.C29
!IRQ0: EXP.C18
!IRQ1: EXP.C19
!IRQ2: EXP.C20
!IRQ3: EXP.A13
!IRQ4: EXP.A14
!IRQ5: EXP.A15
!IRQ6: EXP.A16
!IRQ7: EXP.A18
!IRQS: EXP.A30
!MEM: EXP.C13 ; also sheet 2
!R: EXP.C15
!RAC: JP5.9 ; also sheet 5
!RDR: JP5.11 ; also sheet 4
!RESET: EXP.C30 ; also sheet 2,3
!RPC: JP5.13 ; also sheet 3
!RSTHOLD: JP1.5
!SKIPEXT: EXP.B6
!STPAC: JP5.3 ; also sheet 5
!STPDR: JP5.5 ; also sheet 4
!SYSDEV: EXP.A28 ; also sheet 2
!T34: EXP.B27
!W: EXP.C16
!WAC: JP5.15 ; also sheet 5
!WALU: JP1.7
!WAR: JP5.17 ; also sheet 2
!WDR: JP5.19 ; also sheet 4
!WIR: JP5.36 ; also sheet 2
!WPC: JP5.21 ; also sheet 3
!WS: EXP.B8
*TPA: EXP.A17
*TPC: EXP.C17
+3.3V: EXP.A4 EXP.B4 EXP.C4
+12V [LED power]: EXP.A31 EXP.B31 EXP.C31
AB0: EXP.A5 ; also sheet 2
AB1: EXP.A6 ; also sheet 2
AB2: EXP.A7 ; also sheet 2
AB3: EXP.A8 ; also sheet 2
AB4: EXP.A9 ; also sheet 2
AB5: EXP.A10 ; also sheet 2
AB6: EXP.A11 ; also sheet 2
AB7: EXP.A12 ; also sheet 2
AB8: EXP.A20 ; also sheet 2
AB9: EXP.A21 ; also sheet 2
AB10: EXP.A22 ; also sheet 2
AB11: EXP.A23 ; also sheet 2
AB12: EXP.A24 ; also sheet 2
AB13: EXP.A25 ; also sheet 2
AB14: EXP.A26 ; also sheet 2
AB15: EXP.A27 ; also sheet 2
AC0: JP1.2 ; also sheet 5
AC1: JP1.4 ; also sheet 5
AC2: JP1.6 ; also sheet 5
AC3: JP1.8 ; also sheet 5
AC4: JP1.10 ; also sheet 5
AC5: JP1.12 ; also sheet 5
AC6: JP1.14 ; also sheet 5
AC7: JP1.16 ; also sheet 5
AC8: JP1.18 ; also sheet 5
AC9: JP1.20 ; also sheet 5
AC10: JP1.22 ; also sheet 5
AC11: JP1.24 ; also sheet 5
AC12: JP1.26 ; also sheet 5
AC13: JP1.28 ; also sheet 5
AC14: JP1.30 ; also sheet 5
AC15: JP1.32 ; also sheet 5
AEXT0: EXP.B13
AEXT1: EXP.B14
AEXT2: EXP.B15
AEXT3: EXP.B16
AEXT4: EXP.B17
AEXT5: EXP.B18
AEXT6: EXP.B19
AEXT7: EXP.B20
CLK1: EXP.A29
CLK2: EXP.B29
CLK3: EXP.B30
CLK4: EXP.B28
DB0: EXP.C5
DB1: EXP.C6
DB2: EXP.C7
DB3: EXP.C8
DB4: EXP.C9
DB5: EXP.C10
DB6: EXP.C11
DB7: EXP.C12
DB8: EXP.C21
DB9: EXP.C22
DB10: EXP.C23
DB11: EXP.C24
DB12: EXP.C25
DB13: EXP.C26
DB14: EXP.C27
DB15: EXP.C28
FL: JP1.9
FNEG: JP5.23 ; also sheet 5
FV: JP1.11
FZERO: JP5.25 ; also sheet 5
GND [low power]: C372.- EXP.A1 EXP.A2 EXP.B1 EXP.B2 EXP.C1 EXP.C2 ; also sheet 2,3,4,5
IBUS0: JP5.2 ; also sheet 2,3,4,5
IBUS1: JP5.4 ; also sheet 2,3,4,5
IBUS2: JP5.6 ; also sheet 2,3,4,5
IBUS3: JP5.8 ; also sheet 2,3,4,5
IBUS4: JP5.10 ; also sheet 2,3,4,5
IBUS5: JP5.12 ; also sheet 2,3,4,5
IBUS6: JP5.14 ; also sheet 2,3,4,5
IBUS7: JP5.16 ; also sheet 2,3,4,5
IBUS8: JP5.18 ; also sheet 2,3,4,5
IBUS9: JP5.20 ; also sheet 2,3,4,5
IBUS10: JP5.22 ; also sheet 2,3,4,5
IBUS11: JP5.24 ; also sheet 2,3,4,5
IBUS12: JP5.26 ; also sheet 2,3,4,5
IBUS13: JP5.28 ; also sheet 2,3,4,5
IBUS14: JP5.30 ; also sheet 2,3,4,5
IBUS15: JP5.32 ; also sheet 2,3,4,5
IR0: JP1.13
IR1: JP1.15
IR2: JP1.17
IR3: JP1.19
PC10: JP5.27 ; also sheet 3
PC11: JP5.29 ; also sheet 3
PC12: JP5.31 ; also sheet 3
PC13: JP5.33 ; also sheet 3
PC14: JP5.35 ; also sheet 3
PC15: JP5.37 ; also sheet 3
RUNIT0: JP1.21
RUNIT1: JP1.23
RUNIT2: JP1.25
RUNIT3: JP1.27
VCC [low power]: C372.+ EXP.A3 EXP.A32 EXP.B3 EXP.B32 EXP.C3 EXP.C32 ; also sheet 2,3,4,5
Unconnected: EXP.B5 EXP.B9 EXP.B10 EXP.B11 EXP.B12 EXP.B21 EXP.B22 EXP.B23 J1.33 J1.34 J1.35 J1.36 J1.37 J1.38 J1.39 J1.40 J2.17 J2.18 J2.19 J2.20 J2.21 J2.22 J2.23 J2.24 J2.25 J2.26 J2.27 J2.28 J2.29 J2.30 J2.31 J2.32 J2.33 J2.34 J2.35 J2.36 J2.37 J2.38 J2.39 J2.40 JP1.29 JP1.31 JP1.33 JP1.35 JP1.37 JP1.38 JP1.39 JP1.40 JP5.1 JP5.34 JP5.39

### Buses
IBUS[0..15]

### Notes on the sheet
- CFT Mini-Computer
- Expansion Bus (computer bus)
- (1) | (1) | (1)
- (3)
- (3)
- (3)
- (3)
- (3)
- Control Bus, Port 1
- (2) | (2)
- (3)
- (3)
- (3)
- (5)
- Spare Front Panel Connectors
- (Some pins on other sheets)
- PCB @ (0, 1.95) | (4)
- Notes
- (1) This pin is connected to a bus bar for power distribution, but the CFT does not (yet) require it.
- It's likely to be connected to another voltage level like +3.3V for easier interfacing. Reserved for now.
- Control Bus, Port 2
- (2) Pins *TPA and *TPC are not bussed. They are locally connected to each card's corresponding
- test pins (A17 & C17) to serve as test points.
- (3) Reserved for future expansion
- (4) Cheaper, 64-pin A+C row DIN41662 Type C plugs may be used for most expansion cards.
- (5) !IRQ! is provided for systems which lack an interrupt controller (!IRQ0-7!)
- @ (.175, 3.675)
- @ (5.8, 3.675)
- @ (5.8, .225)
- U
- @ (.175, .225)

## Power pins joined to a net without a drawn wire
GND: IC1.3(GND) IC56.10(GND) IC57.10(GND) IC58.10(GND) IC59.10(GND) IC60.8(GND) IC63.7(P:GND) IC64.10(GND) IC65.8(GND) IC66.3(GND) IC67.8(GND) IC68.8(GND) IC69.8(GND) IC70.8(GND) IC71.10(GND) IC72.10(GND) IC73.10(GND) IC74.10(GND) IC75.8(P:GND) IC76.8(GND) IC77.8(GND) IC78.8(GND) IC79.8(GND) IC80.10(GND) IC81.10(GND) IC82.10(GND) IC83.10(GND) IC84.8(GND) IC85.8(GND) IC86.8(GND) IC87.8(GND) IC88.10(GND) IC89.10(GND) IC90.10(GND) IC91.10(GND) IC92.3(GND) IC93.10(GND) IC94.10(GND)
VCC: IC1.5(VCC) IC56.20(VCC) IC57.20(VCC) IC58.20(VCC) IC59.20(VCC) IC60.16(VCC) IC63.14(P:VCC) IC64.20(VCC) IC65.16(VCC) IC66.5(VCC) IC67.16(VCC) IC68.16(VCC) IC69.16(VCC) IC70.16(VCC) IC71.20(VCC) IC72.20(VCC) IC73.20(VCC) IC74.20(VCC) IC75.16(P:VCC) IC76.16(VCC) IC77.16(VCC) IC78.16(VCC) IC79.16(VCC) IC80.20(VCC) IC81.20(VCC) IC82.20(VCC) IC83.20(VCC) IC84.16(VCC) IC85.16(VCC) IC86.16(VCC) IC87.16(VCC) IC88.20(VCC) IC89.20(VCC) IC90.20(VCC) IC91.20(VCC) IC92.5(VCC) IC93.20(VCC) IC94.20(VCC)

## Library data of the parts
C63-C70 C72-C101 = rcl:C-EU: CAPACITOR, European symbol
C372 = rcl:CPOL-EU: POLARIZED CAPACITOR, European symbol
EXP = alexios-19inch:VG96-3: PCB EUROCARD, 96-pin type C/ABC, 2.54 mm
H1-H4 = alexios:HOLE: Hole for a standoff or mount. Hole diameter: 3.3mm. External Diameter: 6mm.
IC1 = alexios:74*1G08: 2-input AND gate
IC56 IC57 = alexios:74*574: 8-bit D type FLIP FLOP bus driver
IC58 IC59 IC71-IC74 IC80-IC83 IC88 IC89 IC93 IC94 = alexios:74*541: Octal BUFFER and LINE DRIVER, 3-state
IC60 IC65 = alexios:74*138: 3-line to 8-line DECODER/DEMULTIPLEXER
IC63 = alexios:74*74: Dual D type positive edge triggered FLIP FLOP, preset and clear
IC64 IC90 IC91 = alexios:74*688: 8-bit MAGNITUDE/IDENTITY COMPARATOR, totem pole
IC66 IC92 = alexios:74*1G04: INVERTER Gate
IC67-IC70 IC76-IC79 IC84-IC87 = alexios:74*193: Presettable Synchronous Binary Up/Down Counter Up/down 4-bit binary counter with load and clear inputs, and borrow and carry outputs. Farnell description: <http://uk.farnell.com/nxp/74hct193n/ic-74hct-cmos-74hct193-dip16-5v/dp/382218> Order Code: 382218 Manufacturer Part No: 74HCT193N RoHS : Yes Description: IC, 74HCT CMOS, 74HCT193, DIP16, 5V Counter Type:Binary Clock Frequency:47MHz Count Maximum:15 Supply Voltage Range:4.5V to 5.5V Logic Case Style:DIP No. of Pins:16 Operating Temperature Range:-40°C to +125°C Base Number:74 Clock Frequency Max:43MHz Count Max:16 Counter Measuring Functions:Presettable Synchronous Binary Up / Down Counter Device Marking:74HCT193 IC Generic Number:74HCT193 Logic Function Number:193 Logic IC Base Number:74193 Logic IC Family:HCT Logic IC Function:Presettable Synchronous 4bit Binary Up/Down Counter No. of Gates:1 No. of Inputs:4 Operating Temperature Max:125°C Operating Temperature Min:-40°C Package / Case:DIP Supply Voltage:5V Supply Voltage Max:5.5V Supply Voltage Min:4.5V Termination Type:Through Hole
IC75 = alexios:74*139: Dual 2-line to 4-line DECODER/DEMULTIPLEXER
J1 J2 = con-3m:2540-: 3M (TM) Pak 100 4-Wall Header Source: 3M; OC_FARNELL: 9838414; OC_NEWARK: unknown
JP1 JP5 = con-lsta:FE20-2: FEMALE HEADER; OC_FARNELL: unknown; OC_NEWARK: unknown
X1 = alexios:SIGNAL-RENAME: Connect two signals of different names.

## Net classes
0 default: width 0.152 mm, clearance 0.152 mm
1 low power: width 0.305 mm, clearance 0.152 mm
2 LED power: width 0.406 mm, clearance 0.254 mm

## Board
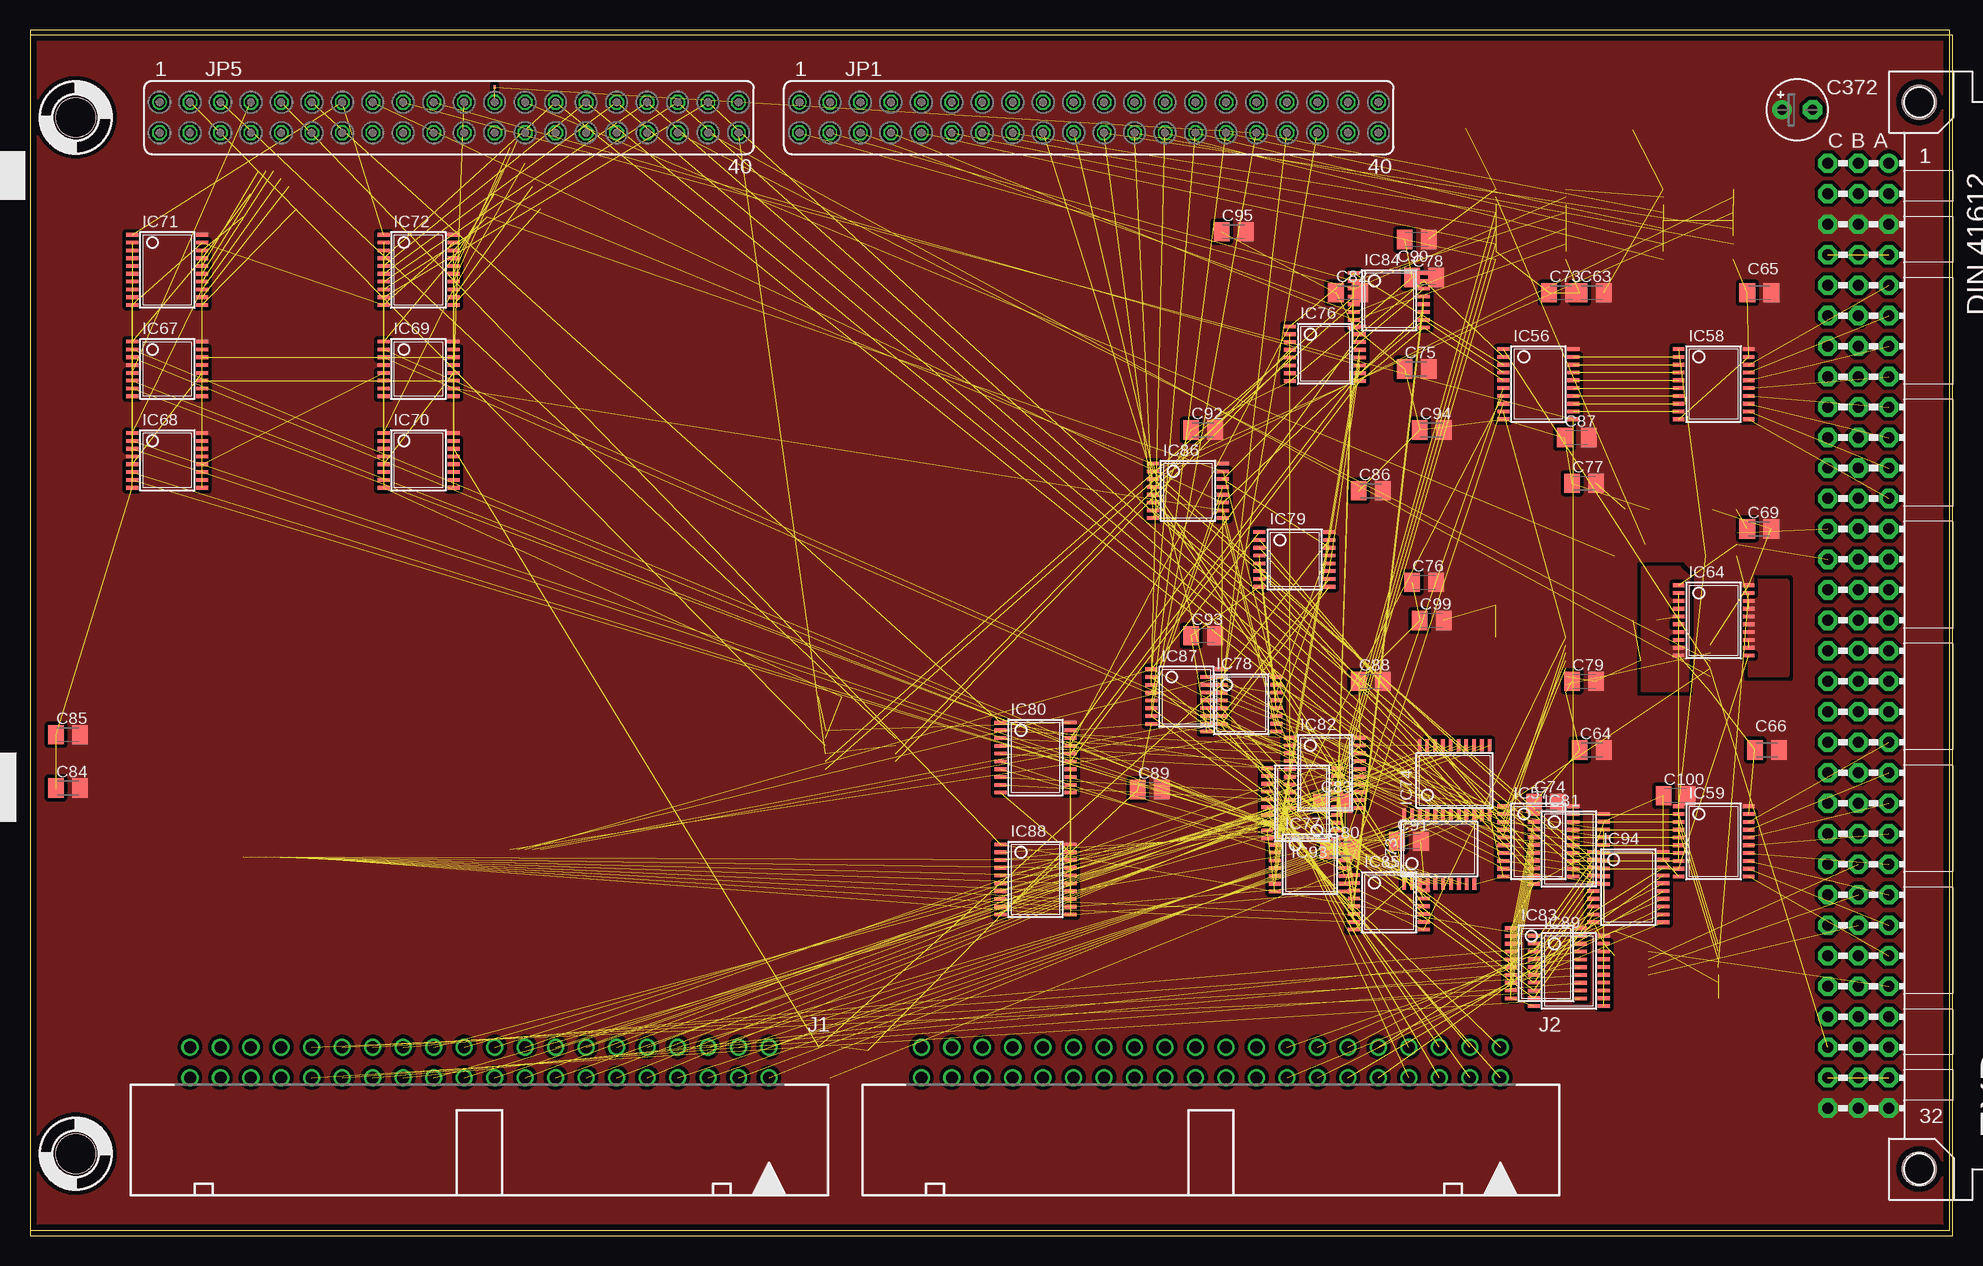
[diagram p6: board, top side]
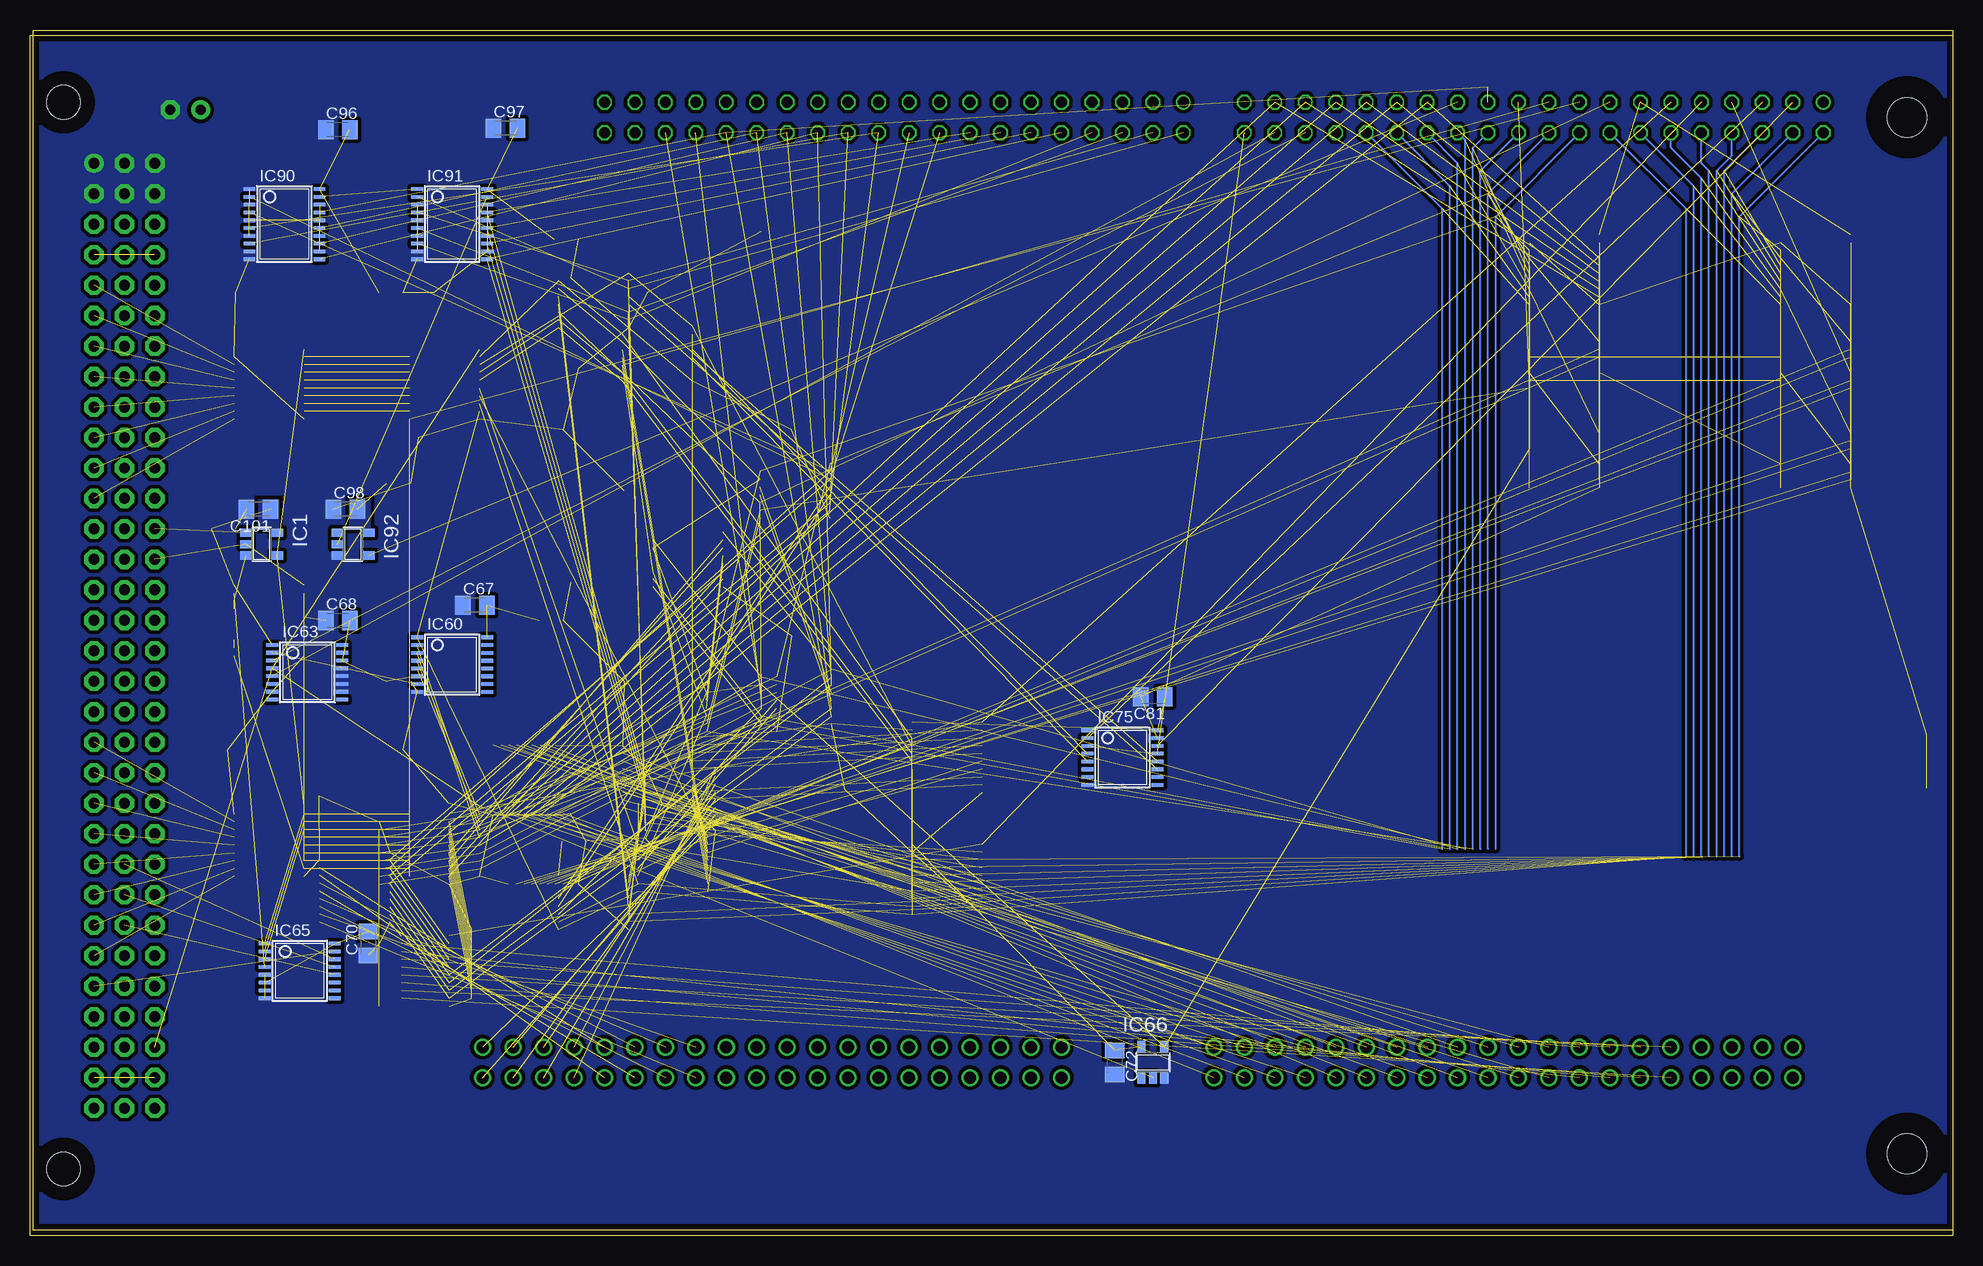
[diagram p7: board, bottom side, seen from below]

Size 160 x 100 mm. Coordinates in mm from the lower left corner, seen from the top.
Outline: 0,0 160,0 160,100 0,100 0,0
Copper layers (1*16): Top 0.035mm / dielectric 0.2mm / Bottom 0.035mm
Design rules "MyroPCB-6mil-prototyping": minimum track width 6mil, minimum drill 12mil, track to track 6mil, track to pad 6mil, pad to pad 6mil, via to via 6mil, smd to smd 6mil, copper to edge 20mil, drill to drill 8mil, minimum pad ring 6mil, minimum via ring 6mil, stop-mask expansion 4mil, vias tented up to drill 0mil, thermal gap 6mil

### Footprints (pad centres in the part's own frame; a part is rotated, then mirrored left to right if it is on the bottom)
C0805K = smd 1.3 x 1.6: 1 -1,0; 2 1,0
E2,5-5 = drill 0.813 pad 1.6 round: + -1.27,0 | drill 0.813 pad 1.6 octagon: - 1.27,0
VG96K = drill 0.914 pad 1.6 round: A1 154.94,39.37 | drill 0.914 pad 1.6 octagon: A2 154.94,36.83; A3 154.94,34.29; A4 154.94,31.75; A5 154.94,29.21; A6 154.94,26.67; A7 154.94,24.13; A8 154.94,21.59; A9 154.94,19.05; A10 154.94,16.51; A11 154.94,13.97; A12 154.94,11.43; A13 154.94,8.89; A14 154.94,6.35; A15 154.94,3.81; A16 154.94,1.27; A17 154.94,-1.27; A18 154.94,-3.81; A19 154.94,-6.35; A20 154.94,-8.89; A21 154.94,-11.43; A22 154.94,-13.97; A23 154.94,-16.51; A24 154.94,-19.05; A25 154.94,-21.59; A26 154.94,-24.13; A27 154.94,-26.67; A28 154.94,-29.21; A29 154.94,-31.75; A30 154.94,-34.29; A31 154.94,-36.83; A32 154.94,-39.37; B1 152.4,39.37; B2 152.4,36.83; B3 152.4,34.29; B4 152.4,31.75; B5 152.4,29.21; B6 152.4,26.67; B7 152.4,24.13; B8 152.4,21.59; B9 152.4,19.05; B10 152.4,16.51; B11 152.4,13.97; B12 152.4,11.43; B13 152.4,8.89; B14 152.4,6.35; B15 152.4,3.81; B16 152.4,1.27; B17 152.4,-1.27; B18 152.4,-3.81; B19 152.4,-6.35; B20 152.4,-8.89; B21 152.4,-11.43; B22 152.4,-13.97; B23 152.4,-16.51; B24 152.4,-19.05; B25 152.4,-21.59; B26 152.4,-24.13; B27 152.4,-26.67; B28 152.4,-29.21; B29 152.4,-31.75; B30 152.4,-34.29; B31 152.4,-36.83; B32 152.4,-39.37; C1 149.86,39.37; C2 149.86,36.83; C3 149.86,34.29; C4 149.86,31.75; C5 149.86,29.21; C6 149.86,26.67; C7 149.86,24.13; C8 149.86,21.59; C9 149.86,19.05; C10 149.86,16.51; C11 149.86,13.97; C12 149.86,11.43; C13 149.86,8.89; C14 149.86,6.35; C15 149.86,3.81; C16 149.86,1.27; C17 149.86,-1.27; C18 149.86,-3.81; C19 149.86,-6.35; C20 149.86,-8.89; C21 149.86,-11.43; C22 149.86,-13.97; C23 149.86,-16.51; C24 149.86,-19.05; C25 149.86,-21.59; C26 149.86,-24.13; C27 149.86,-26.67; C28 149.86,-29.21; C29 149.86,-31.75; C30 149.86,-34.29; C31 149.86,-36.83; C32 149.86,-39.37 | hole 2.794: 157.48,44.45; 157.48,-44.45
STANDOFF_28_60 = hole 3.302: 0,0
SOT23-5 = smd 0.69 x 0.99: 1 -0.95,-1.29; 2 0,-1.29; 3 0.95,-1.29; 4 0.95,1.3; 5 -0.95,1.3
TSSOP20 = smd 0.305 x 0.991: 1 -2.925,-2.918; 2 -2.275,-2.918; 3 -1.625,-2.918; 4 -0.975,-2.918; 5 -0.325,-2.918; 6 0.325,-2.918; 7 0.975,-2.918; 8 1.625,-2.918; 9 2.275,-2.918; 10 2.925,-2.918; 11 2.925,2.918; 12 2.275,2.918; 13 1.625,2.918; 14 0.975,2.918; 15 0.325,2.918; 16 -0.325,2.918; 17 -0.975,2.918; 18 -1.625,2.918; 19 -2.275,2.918; 20 -2.925,2.918
TSSOP16 = smd 0.305 x 0.991: 1 -3.545,-2.918; 2 -2.895,-2.918; 3 -2.245,-2.918; 4 -1.595,-2.918; 5 -0.945,-2.918; 6 -0.295,-2.918; 7 0.355,-2.918; 8 1.005,-2.918; 9 1.005,2.918; 10 0.355,2.918; 11 -0.295,2.918; 12 -0.945,2.918; 13 -1.595,2.918; 14 -2.245,2.918; 15 -2.895,2.918; 16 -3.545,2.918
PAK100/2500-5-40 = drill 1 pad 1.422 round: 1 -24.13,-1.27; 2 -24.13,1.27; 3 -21.59,-1.27; 4 -21.59,1.27; 5 -19.05,-1.27; 6 -19.05,1.27; 7 -16.51,-1.27; 8 -16.51,1.27; 9 -13.97,-1.27; 10 -13.97,1.27; 11 -11.43,-1.27; 12 -11.43,1.27; 13 -8.89,-1.27; 14 -8.89,1.27; 15 -6.35,-1.27; 16 -6.35,1.27; 17 -3.81,-1.27; 18 -3.81,1.27; 19 -1.27,-1.27; 20 -1.27,1.27; 21 1.27,-1.27; 22 1.27,1.27; 23 3.81,-1.27; 24 3.81,1.27; 25 6.35,-1.27; 26 6.35,1.27; 27 8.89,-1.27; 28 8.89,1.27; 29 11.43,-1.27; 30 11.43,1.27; 31 13.97,-1.27; 32 13.97,1.27; 33 16.51,-1.27; 34 16.51,1.27; 35 19.05,-1.27; 36 19.05,1.27; 37 21.59,-1.27; 38 21.59,1.27; 39 24.13,-1.27; 40 24.13,1.27
FE20-2 = drill 0.914 round: 1 -24.13,1.27 | drill 0.914 octagon: 2 -24.13,-1.27; 3 -21.59,1.27; 4 -21.59,-1.27; 5 -19.05,1.27; 6 -19.05,-1.27; 7 -16.51,1.27; 8 -16.51,-1.27; 9 -13.97,1.27; 10 -13.97,-1.27; 11 -11.43,1.27; 12 -11.43,-1.27; 13 -8.89,1.27; 14 -8.89,-1.27; 15 -6.35,1.27; 16 -6.35,-1.27; 17 -3.81,1.27; 18 -3.81,-1.27; 19 -1.27,1.27; 20 -1.27,-1.27; 21 1.27,1.27; 22 1.27,-1.27; 23 3.81,1.27; 24 3.81,-1.27; 25 6.35,1.27; 26 6.35,-1.27; 27 8.89,1.27; 28 8.89,-1.27; 29 11.43,1.27; 30 11.43,-1.27; 31 13.97,1.27; 32 13.97,-1.27; 33 16.51,1.27; 34 16.51,-1.27; 35 19.05,1.27; 36 19.05,-1.27; 37 21.59,1.27; 38 21.59,-1.27; 39 24.13,1.27; 40 24.13,-1.27
SIGNAL-RENAME = smd 0.305 x 0.152: P$1 0,0; P$2 0,0

### Placement (x,y rotation side)
C63  130.18,78.11 0 top
C64  130.18,40.01 0 top
C65  144.15,78.11 0 top
C66  144.78,40.01 0 top
C67  123.19,52.07 0 bottom
C68  134.62,50.8 0 bottom
C69  144.15,58.42 0 top
C70  132.08,23.88 90 bottom
C72  69.85,13.97 270 bottom
C73  127.64,78.11 0 top
C74  126.36,35.56 0 top
C75  115.57,71.75 0 top
C76  116.2,53.98 0 top
C77  129.54,62.23 0 top
C78  116.2,79.38 0 top
C79  129.54,45.72 0 top
C80  109.22,31.75 0 top
C81  66.67,44.45 180 bottom
C82  109.86,78.11 0 top
C83  108.58,35.56 0 top
C84  3.17,36.83 0 top
C85  3.17,41.27 0 top
C86  111.76,61.59 0 top
C87  128.91,66.04 0 top
C88  111.76,45.72 0 top
C89  93.34,36.7 0 top
C90  115.57,82.55 180 top
C91  114.94,32.38 0 top
C92  97.79,66.67 0 top
C93  97.79,49.53 0 top
C94  116.84,66.67 0 top
C95  100.33,83.19 0 top
C96  134.62,91.69 0 bottom
C97  120.65,91.82 0 bottom
C98  133.99,60.07 0 bottom
C99  116.84,50.8 0 top
C100  137.16,36.2 0 top
C101  141.22,60.07 180 bottom
C372  147.32,93.34 0 top
EXP  0,49.53 0 top
H1  22.23,-13.97 0 top  (outside the outline)
H2  15.88,-13.97 0 top  (outside the outline)
H3  3.81,6.35 0 top
H4  3.81,92.71 0 top
IC1  140.97,57.15 270 bottom
IC56  125.73,70.48 270 top
IC57  125.73,32.38 270 top
IC58  140.34,70.48 270 top
IC59  140.34,32.38 270 top
IC60  125.09,45.85 270 bottom
IC63  137.16,45.21 270 bottom
IC64  140.34,50.8 270 top
IC65  137.79,20.32 270 bottom
IC66  66.67,13.97 0 bottom
IC67  11.43,70.48 270 top
IC68  11.43,62.87 270 top
IC69  32.38,70.48 270 top
IC70  32.38,62.87 270 top
IC71  11.43,80.01 270 top
IC72  32.38,80.01 270 top
IC73  117.47,31.75 0 top
IC74  118.75,37.47 0 top
IC75  69.22,38.1 270 bottom
IC76  107.95,71.75 270 top
IC77  106.68,29.21 270 top
IC78  100.97,42.55 270 top
IC79  105.41,54.61 270 top
IC80  83.82,39.37 270 top
IC81  128.27,31.75 270 top
IC82  107.95,38.1 270 top
IC83  126.36,22.23 270 top
IC84  113.28,76.2 270 top
IC85  113.28,26.04 270 top
IC86  96.52,60.33 270 top
IC87  96.39,43.18 270 top
IC88  83.82,29.21 270 top
IC89  128.27,21.59 270 top
IC90  139.06,83.82 270 bottom
IC91  125.09,83.82 270 bottom
IC92  133.35,57.15 270 bottom
IC93  106.05,35.56 90 top
IC94  133.22,28.57 270 top
J1  37.47,13.97 180 top
J2  98.42,13.97 180 top
JP1  88.27,92.71 0 top
JP5  34.92,92.71 0 top
X1  38.73,95.25 90 top

### Tracks (layer width: path | path; a pad name or v marks a point on that pad's centre or on a via)
!ABEN  (2 unrouted)
!ACB1  (1 unrouted)
!ACB2  (1 unrouted)
!ACB3  (1 unrouted)
!ACC1  (1 unrouted)
!ACC2  (1 unrouted)
!ACC3  (1 unrouted)
!ACDOWN  (1 unrouted)
!ACUP  (1 unrouted)
!AINDEX  (1 unrouted)
!DEC  (2 unrouted)
!DECCPL  (1 unrouted)
!DRB1  (1 unrouted)
!DRB2  (1 unrouted)
!DRB3  (1 unrouted)
!DRC1  (1 unrouted)
!DRC2  (1 unrouted)
!DRC3  (1 unrouted)
!DRDOWN  (1 unrouted)
!DRUP  (1 unrouted)
!FZERO  (1 unrouted)
!INCCPL  (1 unrouted)
!INCPC  (1 unrouted)
!IO  (2 unrouted)
!IODEV1XX  (1 unrouted)
!IODEV2XX  (1 unrouted)
!IODEV3XX  (1 unrouted)
!IS_AUTOINDEX  (1 unrouted)
!MEM  (1 unrouted)
!RAC  (2 unrouted)
!RDR  (2 unrouted)
!RESET  (4 unrouted)
!RPC  (2 unrouted)
!STPAC  (1 unrouted)
!STPDR  (1 unrouted)
!SYSDEV  (1 unrouted)
!WAC  (4 unrouted)
!WAR  (2 unrouted)
!WDR  (4 unrouted)
!WIR  (1 unrouted)
!WPC  (4 unrouted)
+3.3V  (2 unrouted)
+12V  (2 unrouted)
AB0  (1 unrouted)
AB1  (1 unrouted)
AB2  (1 unrouted)
AB3  (1 unrouted)
AB4  (1 unrouted)
AB5  (1 unrouted)
AB6  (1 unrouted)
AB7  (1 unrouted)
AB8  (1 unrouted)
AB9  (1 unrouted)
AB10  (1 unrouted)
AB11  (1 unrouted)
AB12  (1 unrouted)
AB13  (1 unrouted)
AB14  (1 unrouted)
AB15  (1 unrouted)
AC0  (4 unrouted)
AC1  (4 unrouted)
AC2  (4 unrouted)
AC3  (4 unrouted)
AC4  (4 unrouted)
AC5  (4 unrouted)
AC6  (4 unrouted)
AC7  (4 unrouted)
AC8  (4 unrouted)
AC9  (4 unrouted)
AC10  (4 unrouted)
AC11  (4 unrouted)
AC12  (4 unrouted)
AC13  (4 unrouted)
AC14  (4 unrouted)
AC15  (5 unrouted)
AR0  (1 unrouted)
AR1  (1 unrouted)
AR2  (1 unrouted)
AR3  (1 unrouted)
AR4  (1 unrouted)
AR5  (1 unrouted)
AR6  (1 unrouted)
AR7  (1 unrouted)
AR8  (2 unrouted)
AR9  (2 unrouted)
AR10  (2 unrouted)
AR11  (2 unrouted)
AR12  (2 unrouted)
AR13  (2 unrouted)
AR14  (2 unrouted)
AR15  (2 unrouted)
DR0  (2 unrouted)
DR1  (2 unrouted)
DR2  (2 unrouted)
DR3  (2 unrouted)
DR4  (2 unrouted)
DR5  (2 unrouted)
DR6  (2 unrouted)
DR7  (2 unrouted)
DR8  (2 unrouted)
DR9  (2 unrouted)
DR10  (2 unrouted)
DR11  (2 unrouted)
DR12  (2 unrouted)
DR13  (2 unrouted)
DR14  (2 unrouted)
DR15  (2 unrouted)
FNEG  (1 unrouted)
FZERO  (1 unrouted)
GND  (98 unrouted)
  pour Bottom (isolate 0.305, rank 6, no thermals): 0,99.69 0,-0.64 160.02,-0.64 160.02,99.69
  pour Top (isolate 0.305, no thermals): 146.43,54.1 146.43,46.23 143.38,46.23 143.38,54.1
  pour Top (isolate 0.305, no thermals): 137.54,55.24 138.3,54.48 138.18,44.96 134.37,44.96 134.37,55.24
IBUS0  (7 unrouted)
  Bottom 0.152: 17.78,31.11 17.78,84.45 JP5.2
IBUS1  (7 unrouted)
  Bottom 0.152: 18.41,31.11 18.41,86.36 JP5.4
IBUS2  (7 unrouted)
  Bottom 0.152: 19.05,31.11 19.05,88.27 JP5.6
IBUS3  (7 unrouted)
  Bottom 0.152: 19.68,31.11 19.68,88.27 18.41,89.53 JP5.8
IBUS4  (7 unrouted)
  Bottom 0.152: 20.32,31.11 20.32,88.27 20.95,88.9 JP5.10
IBUS5  (7 unrouted)
  Bottom 0.152: 20.95,31.11 20.95,87.63 23.5,90.17 JP5.12
IBUS6  (7 unrouted)
  Bottom 0.152: 21.59,31.11 21.59,87 JP5.14
IBUS7  (8 unrouted)
  Bottom 0.152: 22.23,31.11 22.23,85.09 JP5.16
IBUS8  (8 unrouted)
  Bottom 0.152: 38.1,31.75 38.1,84.45 JP5.18
IBUS9  (8 unrouted)
  Bottom 0.152: 38.73,31.75 38.73,86.36 JP5.20
IBUS10  (8 unrouted)
  Bottom 0.152: 39.37,31.75 39.37,88.27 JP5.22
IBUS11  (8 unrouted)
  Bottom 0.152: 40.01,31.75 40.01,90.17 JP5.24
IBUS12  (7 unrouted)
  Bottom 0.152: 40.64,31.75 40.64,90.81 JP5.26
IBUS13  (7 unrouted)
  Bottom 0.152: 41.27,31.75 41.27,88.9 JP5.28
IBUS14  (7 unrouted)
  Bottom 0.152: 41.91,31.75 41.91,87 JP5.30
IBUS15  (7 unrouted)
  Bottom 0.152: 42.55,31.75 42.55,85.09 JP5.32
N$70  (1 unrouted)
N$71  (1 unrouted)
N$95  (1 unrouted)
N$734  (1 unrouted)
N$736  (1 unrouted)
N$737  (1 unrouted)
N$738  (1 unrouted)
N$740  (1 unrouted)
N$741  (1 unrouted)
N$742  (1 unrouted)
N$743  (1 unrouted)
N$744  (1 unrouted)
N$745  (1 unrouted)
N$746  (1 unrouted)
N$747  (1 unrouted)
N$748  (1 unrouted)
N$749  (1 unrouted)
N$750  (1 unrouted)
N$751  (1 unrouted)
N$752  (1 unrouted)
N$753  (1 unrouted)
N$754  (1 unrouted)
N$755  (1 unrouted)
N$756  (1 unrouted)
N$757  (1 unrouted)
N$758  (1 unrouted)
N$759  (1 unrouted)
N$760  (1 unrouted)
N$761  (1 unrouted)
N$762  (1 unrouted)
N$763  (1 unrouted)
N$764  (1 unrouted)
N$765  (1 unrouted)
N$766  (1 unrouted)
N$767  (1 unrouted)
N$768  (1 unrouted)
N$773  (1 unrouted)
N$775  (1 unrouted)
N$776  (1 unrouted)
N$777  (1 unrouted)
N$778  (1 unrouted)
N$779  (1 unrouted)
N$780  (1 unrouted)
N$781  (1 unrouted)
N$782  (1 unrouted)
N$783  (1 unrouted)
N$784  (1 unrouted)
N$785  (1 unrouted)
N$786  (1 unrouted)
N$787  (1 unrouted)
N$788  (1 unrouted)
N$789  (1 unrouted)
N$793  (1 unrouted)
PC0  (2 unrouted)
PC1  (2 unrouted)
PC2  (2 unrouted)
PC3  (2 unrouted)
PC4  (2 unrouted)
PC5  (2 unrouted)
PC6  (2 unrouted)
PC7  (2 unrouted)
PC8  (2 unrouted)
PC9  (2 unrouted)
PC10  (3 unrouted)
PC11  (3 unrouted)
PC12  (3 unrouted)
PC13  (3 unrouted)
PC14  (3 unrouted)
PC15  (3 unrouted)
RESET  (12 unrouted)
VCC  (22 unrouted)
  pour Top (isolate 0.305, rank 6, no thermals): 0,99.69 0,-0.64 160.02,-0.64 160.02,99.69
  pour Bottom (isolate 0.305, no thermals): 133.6,60.83 133.6,58.42 132.59,58.42 131.95,57.91 131.95,60.83
  pour Bottom (isolate 0.305, no thermals): 141.22,60.83 141.22,58.42 140.21,58.42 139.57,57.91 139.57,60.83